# Altium project NIR-Spec-Motherboard.PrjPcb
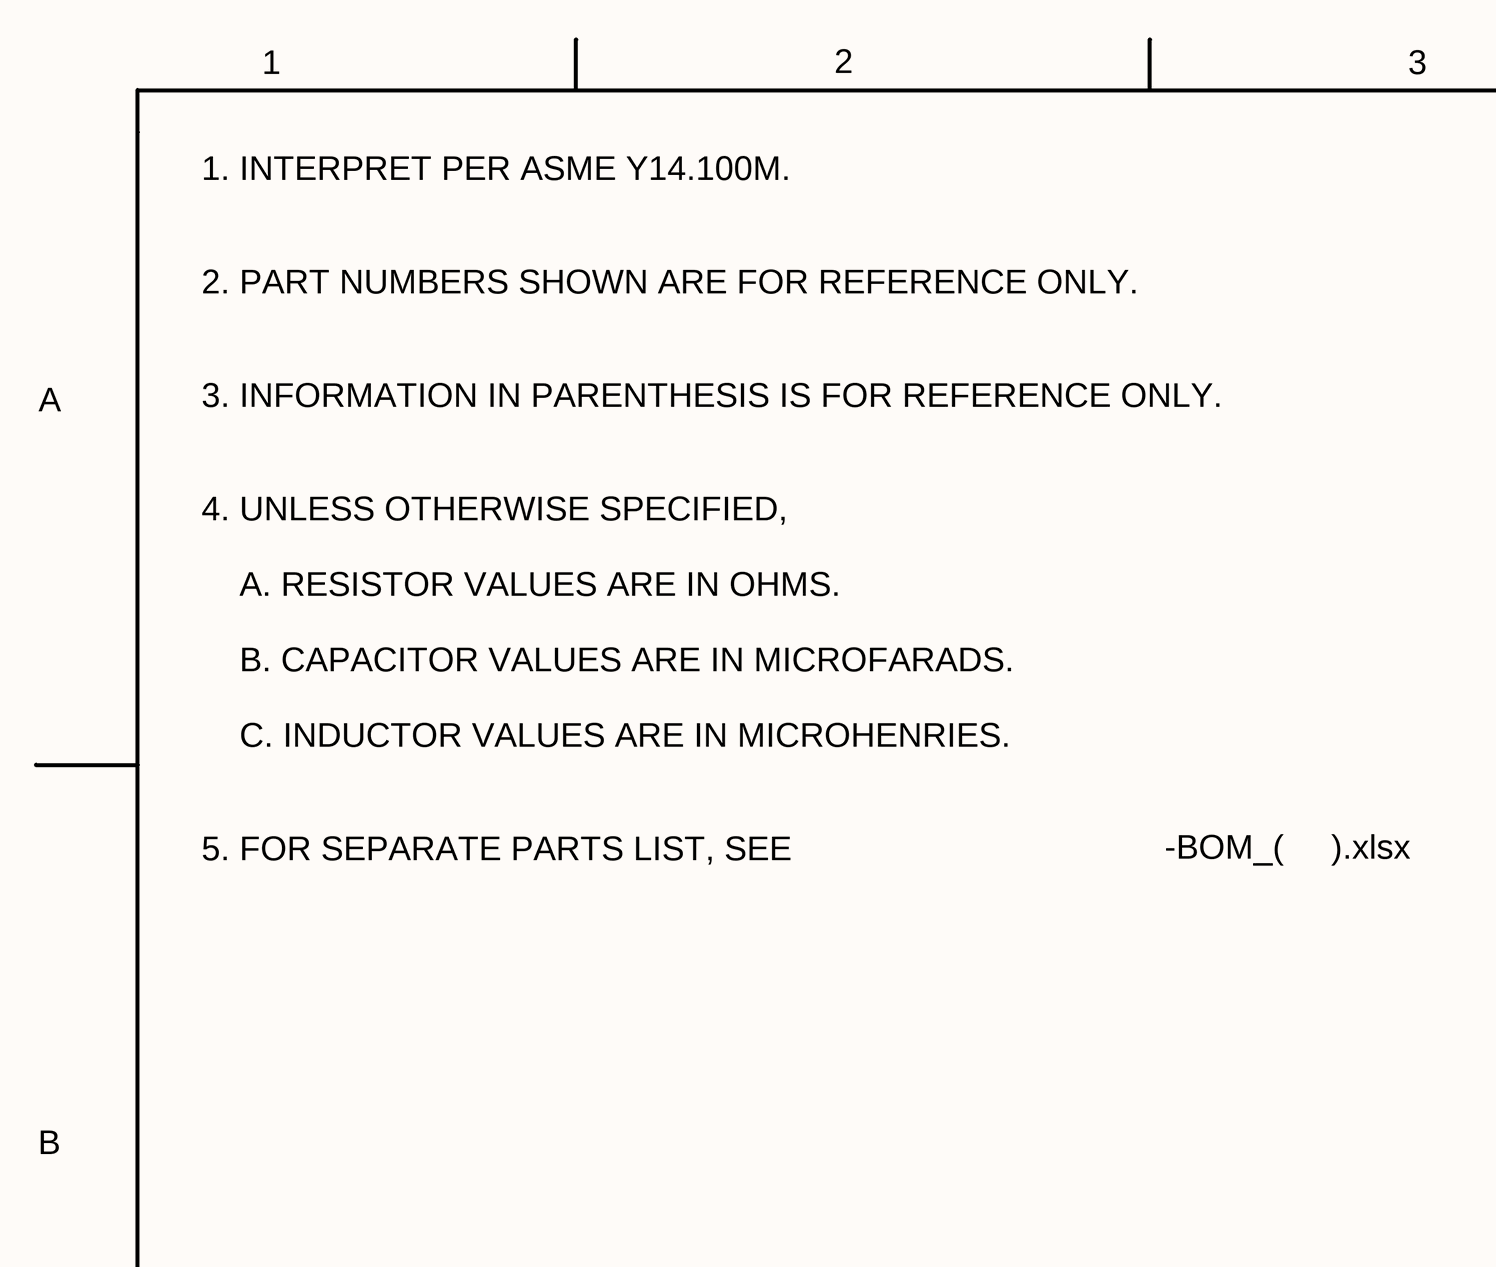
[diagram p0: NIR-Spec-Motherboard-SCH_SH1_(02).SchDoc, top left]
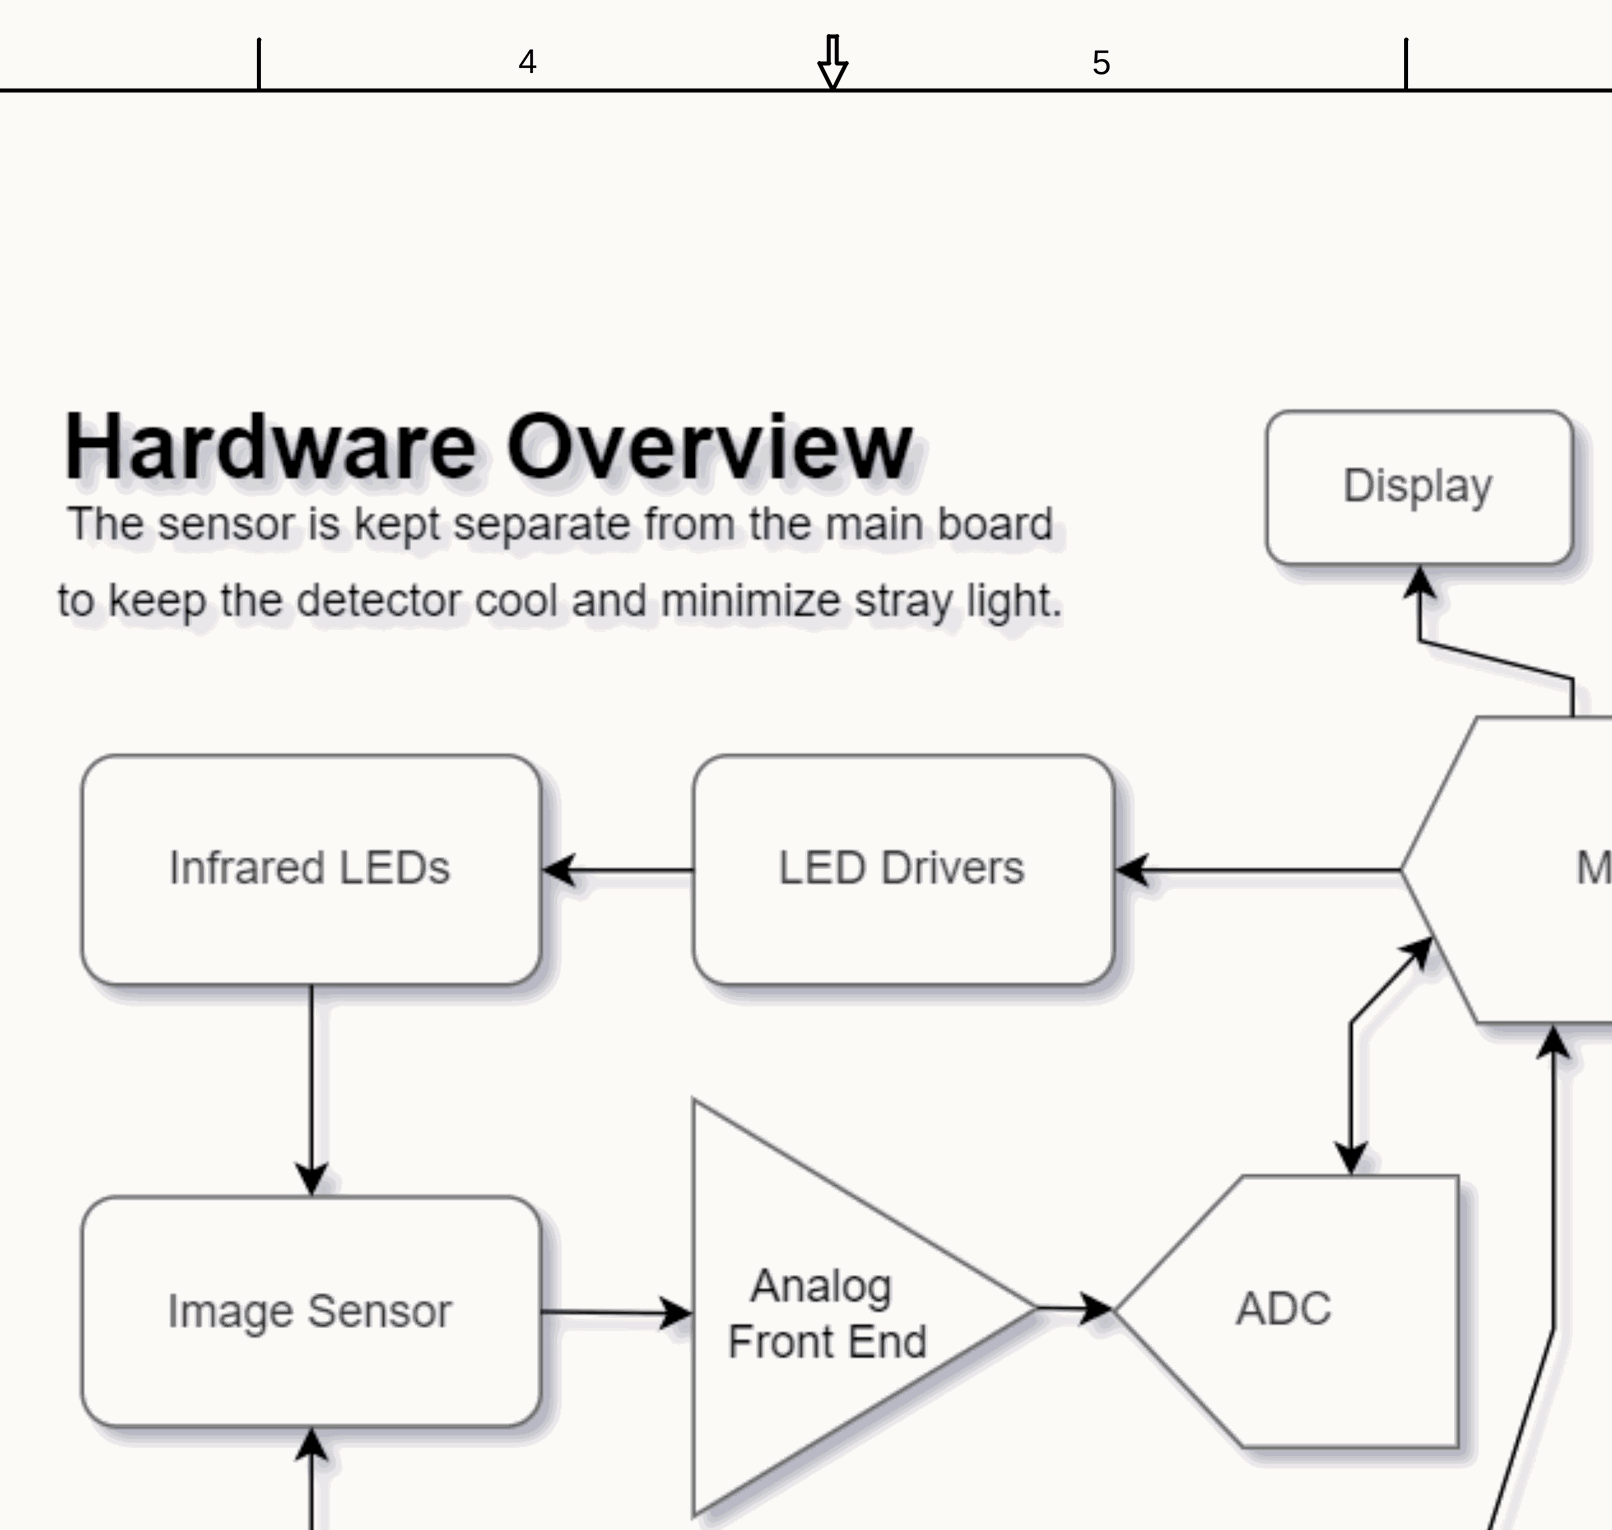
[diagram p1: NIR-Spec-Motherboard-SCH_SH1_(02).SchDoc, top middle]
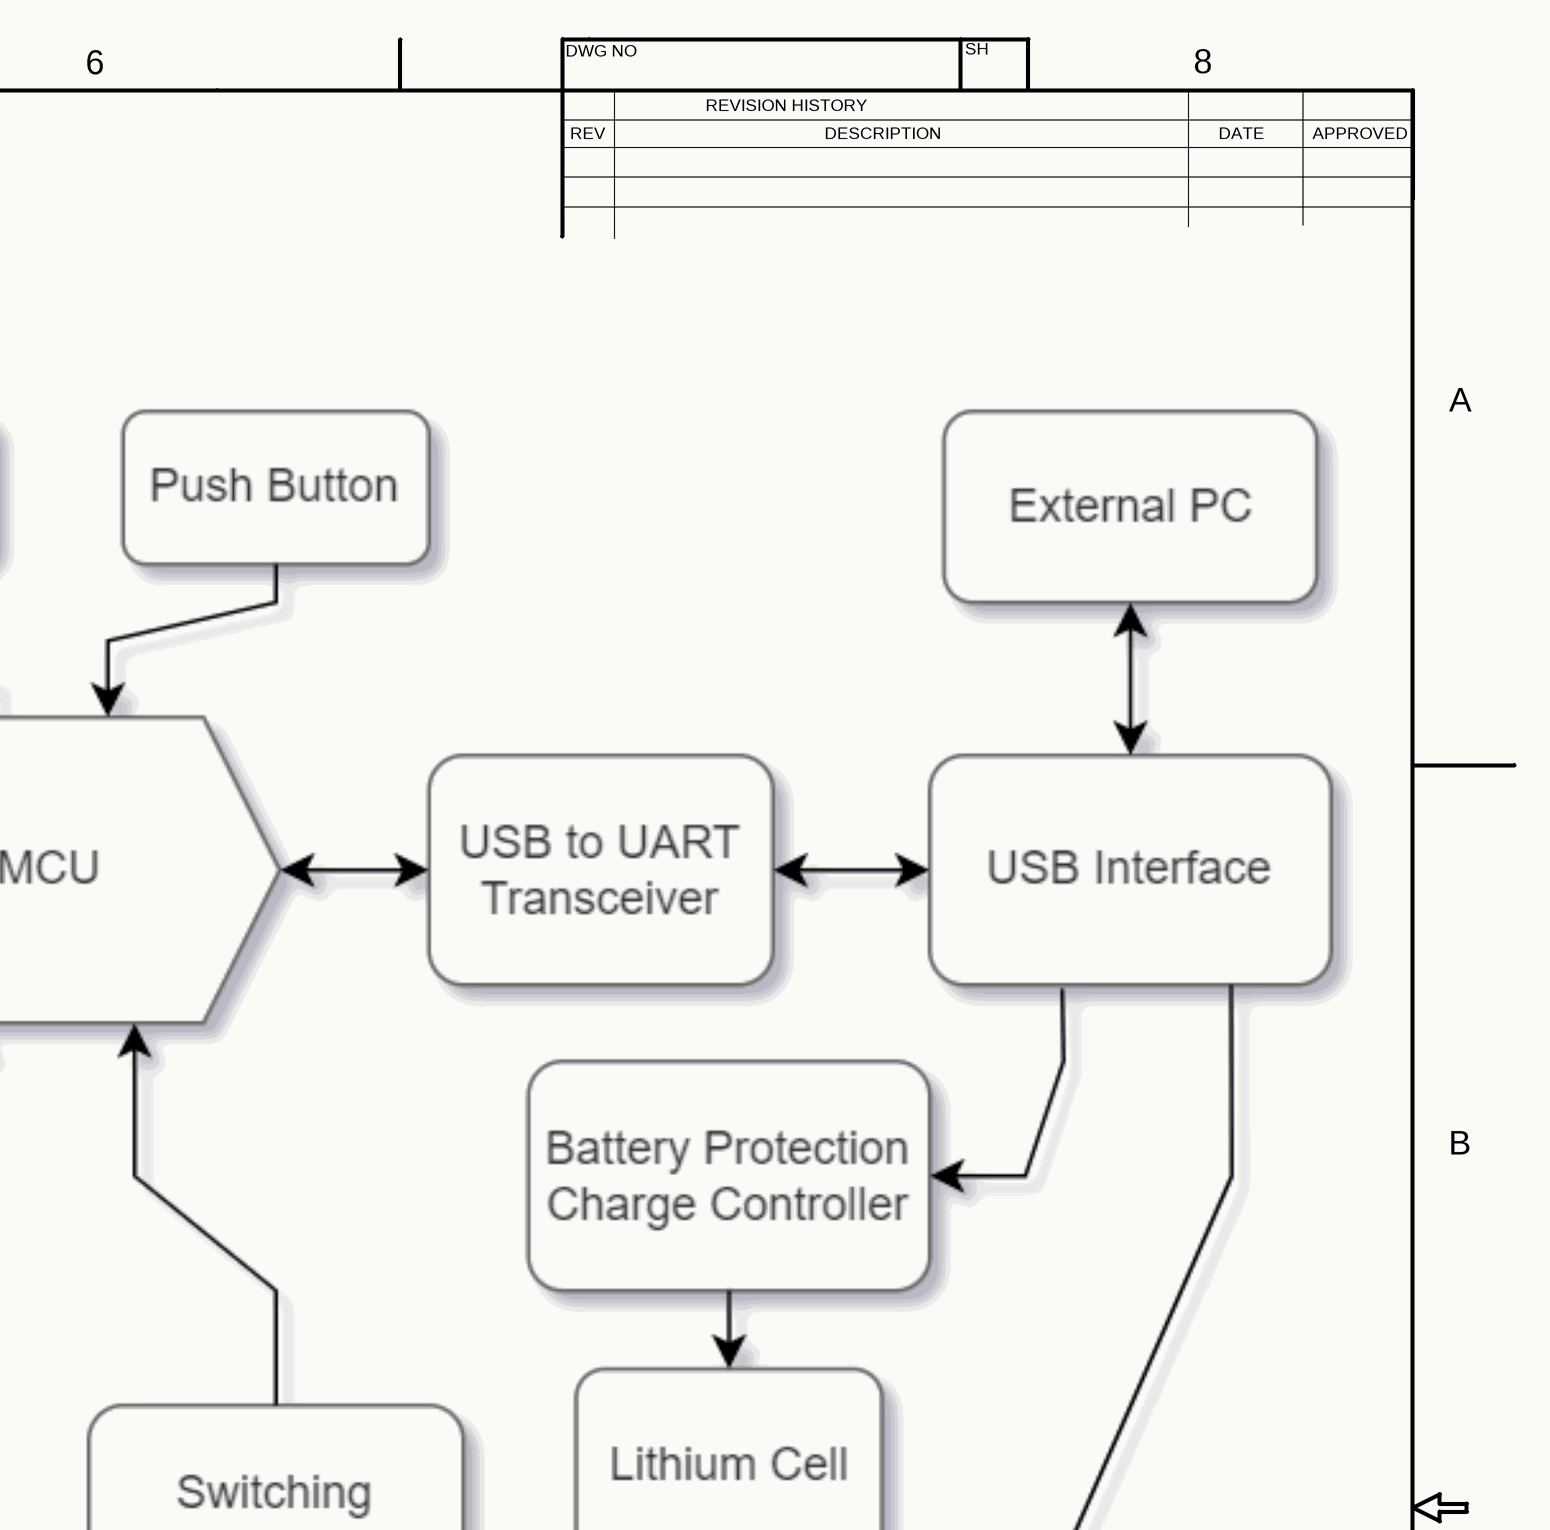
[diagram p2: NIR-Spec-Motherboard-SCH_SH1_(02).SchDoc, top right]
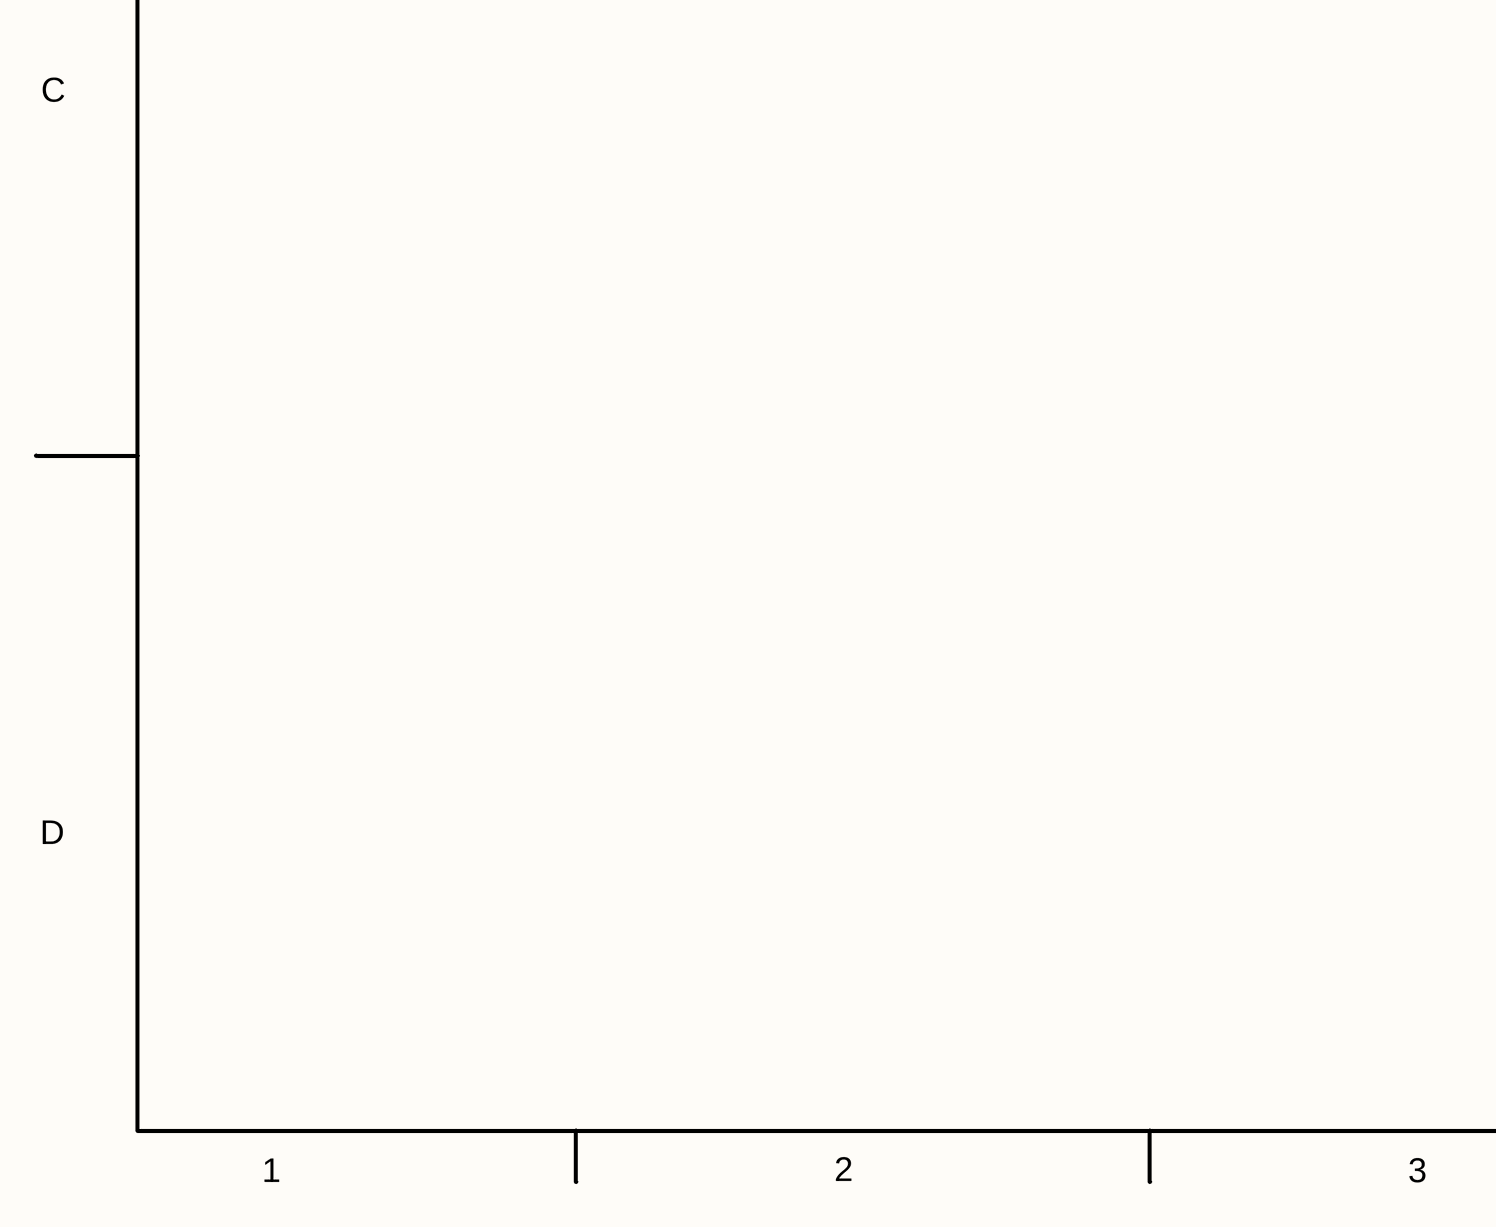
[diagram p3: NIR-Spec-Motherboard-SCH_SH1_(02).SchDoc, bottom left]
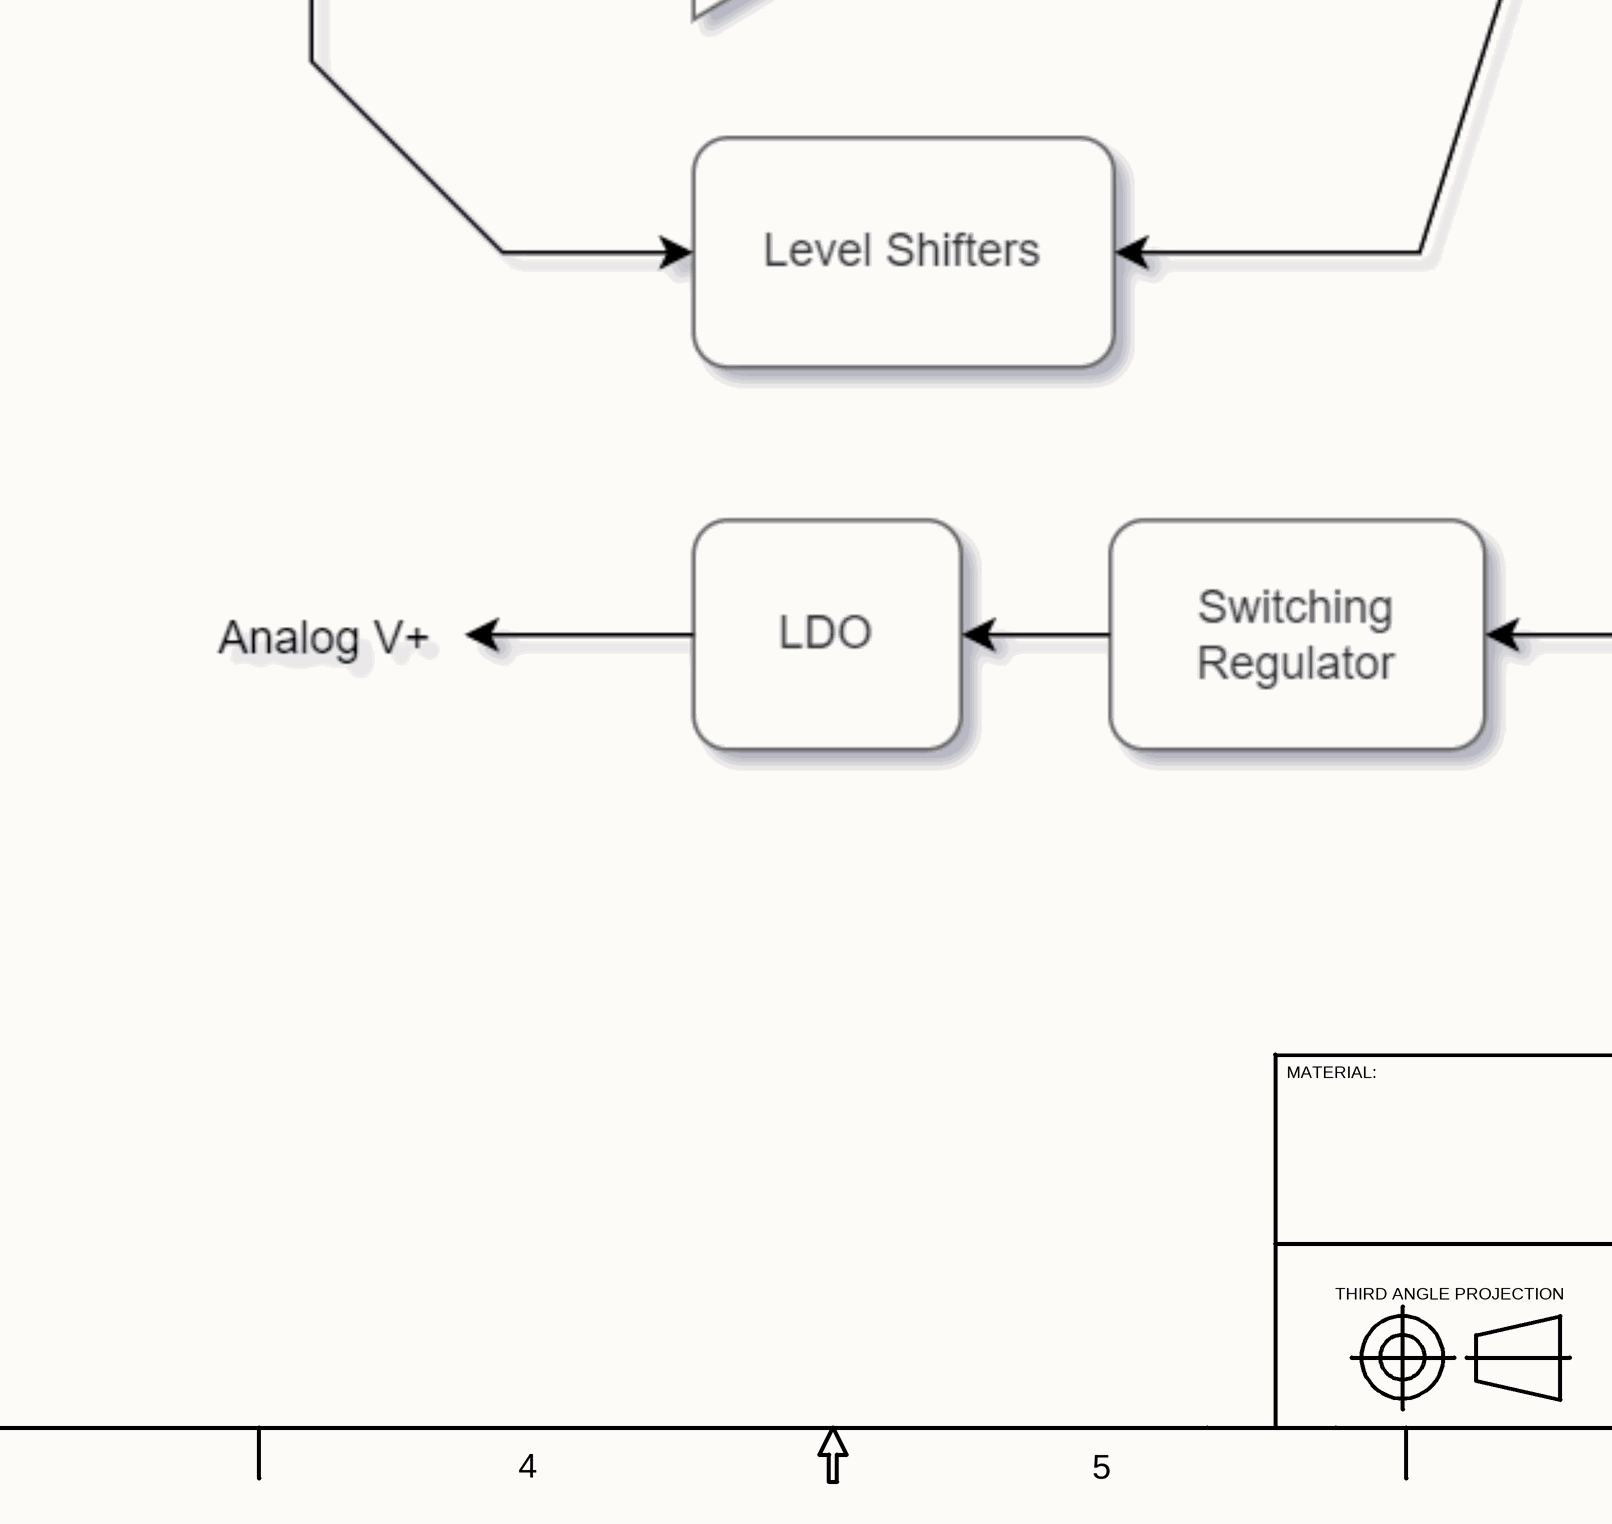
[diagram p4: NIR-Spec-Motherboard-SCH_SH1_(02).SchDoc, bottom middle]
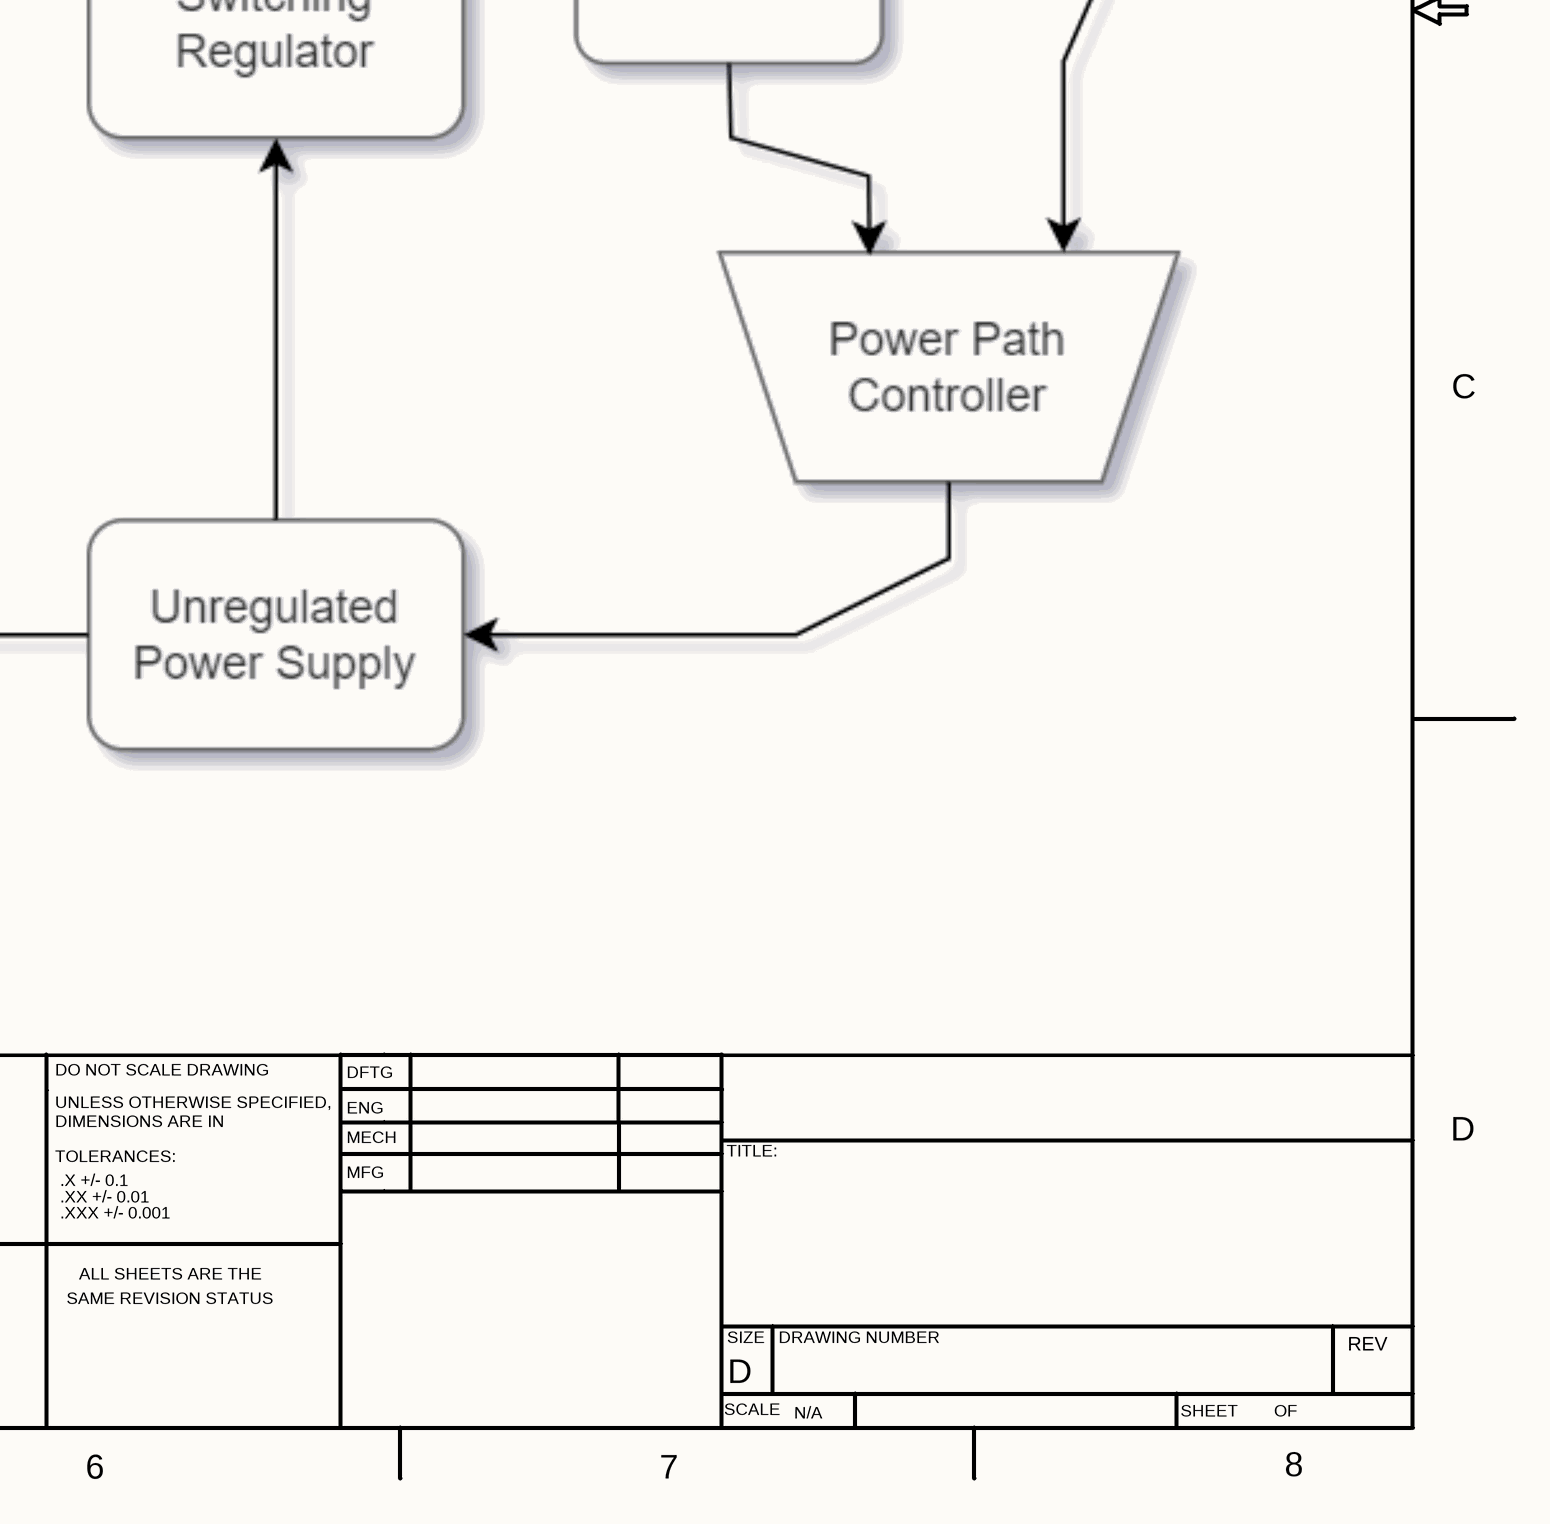
[diagram p5: NIR-Spec-Motherboard-SCH_SH1_(02).SchDoc, bottom right]
Company: -; DateDftg: -; DateEng: -; DocNumber: NIR-Spec; DocNumberPCB: NIR-Spec-PCB; Hist1Appr: -; Hist1Date: -; Hist1Desc: -; Hist1Rev: 01; Hist2Appr: -; Hist2Date: -; Hist2Desc: -; Hist2Rev: -; Hist3Appr: -; Hist3Date: -; Hist3Desc: -; Hist3Rev: -; NameDftg: K. KIDD; NameEng: K. KIDD; Rev: 02; Title0: NIR Spec Motherboard; Title1: SWIR Spectrophotometer; TitleCCA: CIRCUIT CARD ASSEMBLY,; TitlePCB: PRINTED CIRCUIT BOARD,; TitleSCH: SCHEMATIC, CCA,
3 sheets, 132 parts. Net scope: global (net labels, ports and power ports of the same name join across sheets).
Board file: NIR-Spec-Motherboard.PcbDoc
Sheets:
  NIR-Spec-Motherboard-SCH_SH1_(02).SchDoc
  NIR-Spec-Motherboard-SCH_SH2_(02).SchDoc
  NIR-Spec-Motherboard-SCH_SH3_(02).SchDoc

## Sheet NIR-Spec-Motherboard-SCH_SH1_(02).SchDoc: SCHEMATIC, CCA,
size 863 x 558 mm; DocumentNumber: NIR-Spec-1; SheetNumber: 1; SheetTotal: 3

### Notes on the sheet
- 1
- 2
- 3
- 4
- 5
- 6
- DWG NO
- REVISION HISTORY
- SH
- 8
- REV
- DESCRIPTION
- DATE
- APPROVED
- A
- -BOM_(
- ).xlsx
- 1. INTERPRET PER ASME Y14.100M.
  2. PART NUMBERS SHOWN ARE FOR REFERENCE ONLY.
  3. INFORMATION IN PARENTHESIS IS FOR REFERENCE ONLY.
  4. UNLESS OTHERWISE SPECIFIED,
  A. RESISTOR VALUES ARE IN OHMS.
  B. CAPACITOR VALUES ARE IN MICROFARADS.
  C. INDUCTOR VALUES ARE IN MICROHENRIES.
  5. FOR SEPARATE PARTS LIST, SEE
- B
- C
- MATERIAL:
- DO NOT SCALE DRAWING
- UNLESS OTHERWISE SPECIFIED,
- ENG
- DFTG
- D
- DIMENSIONS ARE IN
- TOLERANCES:
- MECH
- MFG
- TITLE:
- .X +/- 0.1
- .XX +/- 0.01
- .XXX +/- 0.001
- THIRD ANGLE PROJECTION
- SAME REVISION STATUS
- ALL SHEETS ARE THE
- SIZE
- DRAWING NUMBER
- SCALE
- N/A
- SHEET        OF
- 7

## Sheet NIR-Spec-Motherboard-SCH_SH2_(02).SchDoc: SCHEMATIC
size 863 x 558 mm; DocumentNumber: NIR-Spec-2; SheetNumber: 2; SheetTotal: 3; PageSetup: Record=PageOptions|CenterHorizontal=True|CenterVertical=True|PrintScale=0.98|XCorrection=1.00|YCorrection=1.00|PrintKind=2|BorderSize=5000000|LeftOffset=0|BottomOffset=0|Orientation=2|PaperLength=1000|PaperWidth=1000|Scale=100|PaperSource=15|PrintQuality=1200|MediaType=1|DitherType=10|PaperKind=11 x 17|PrintScaleMode=1
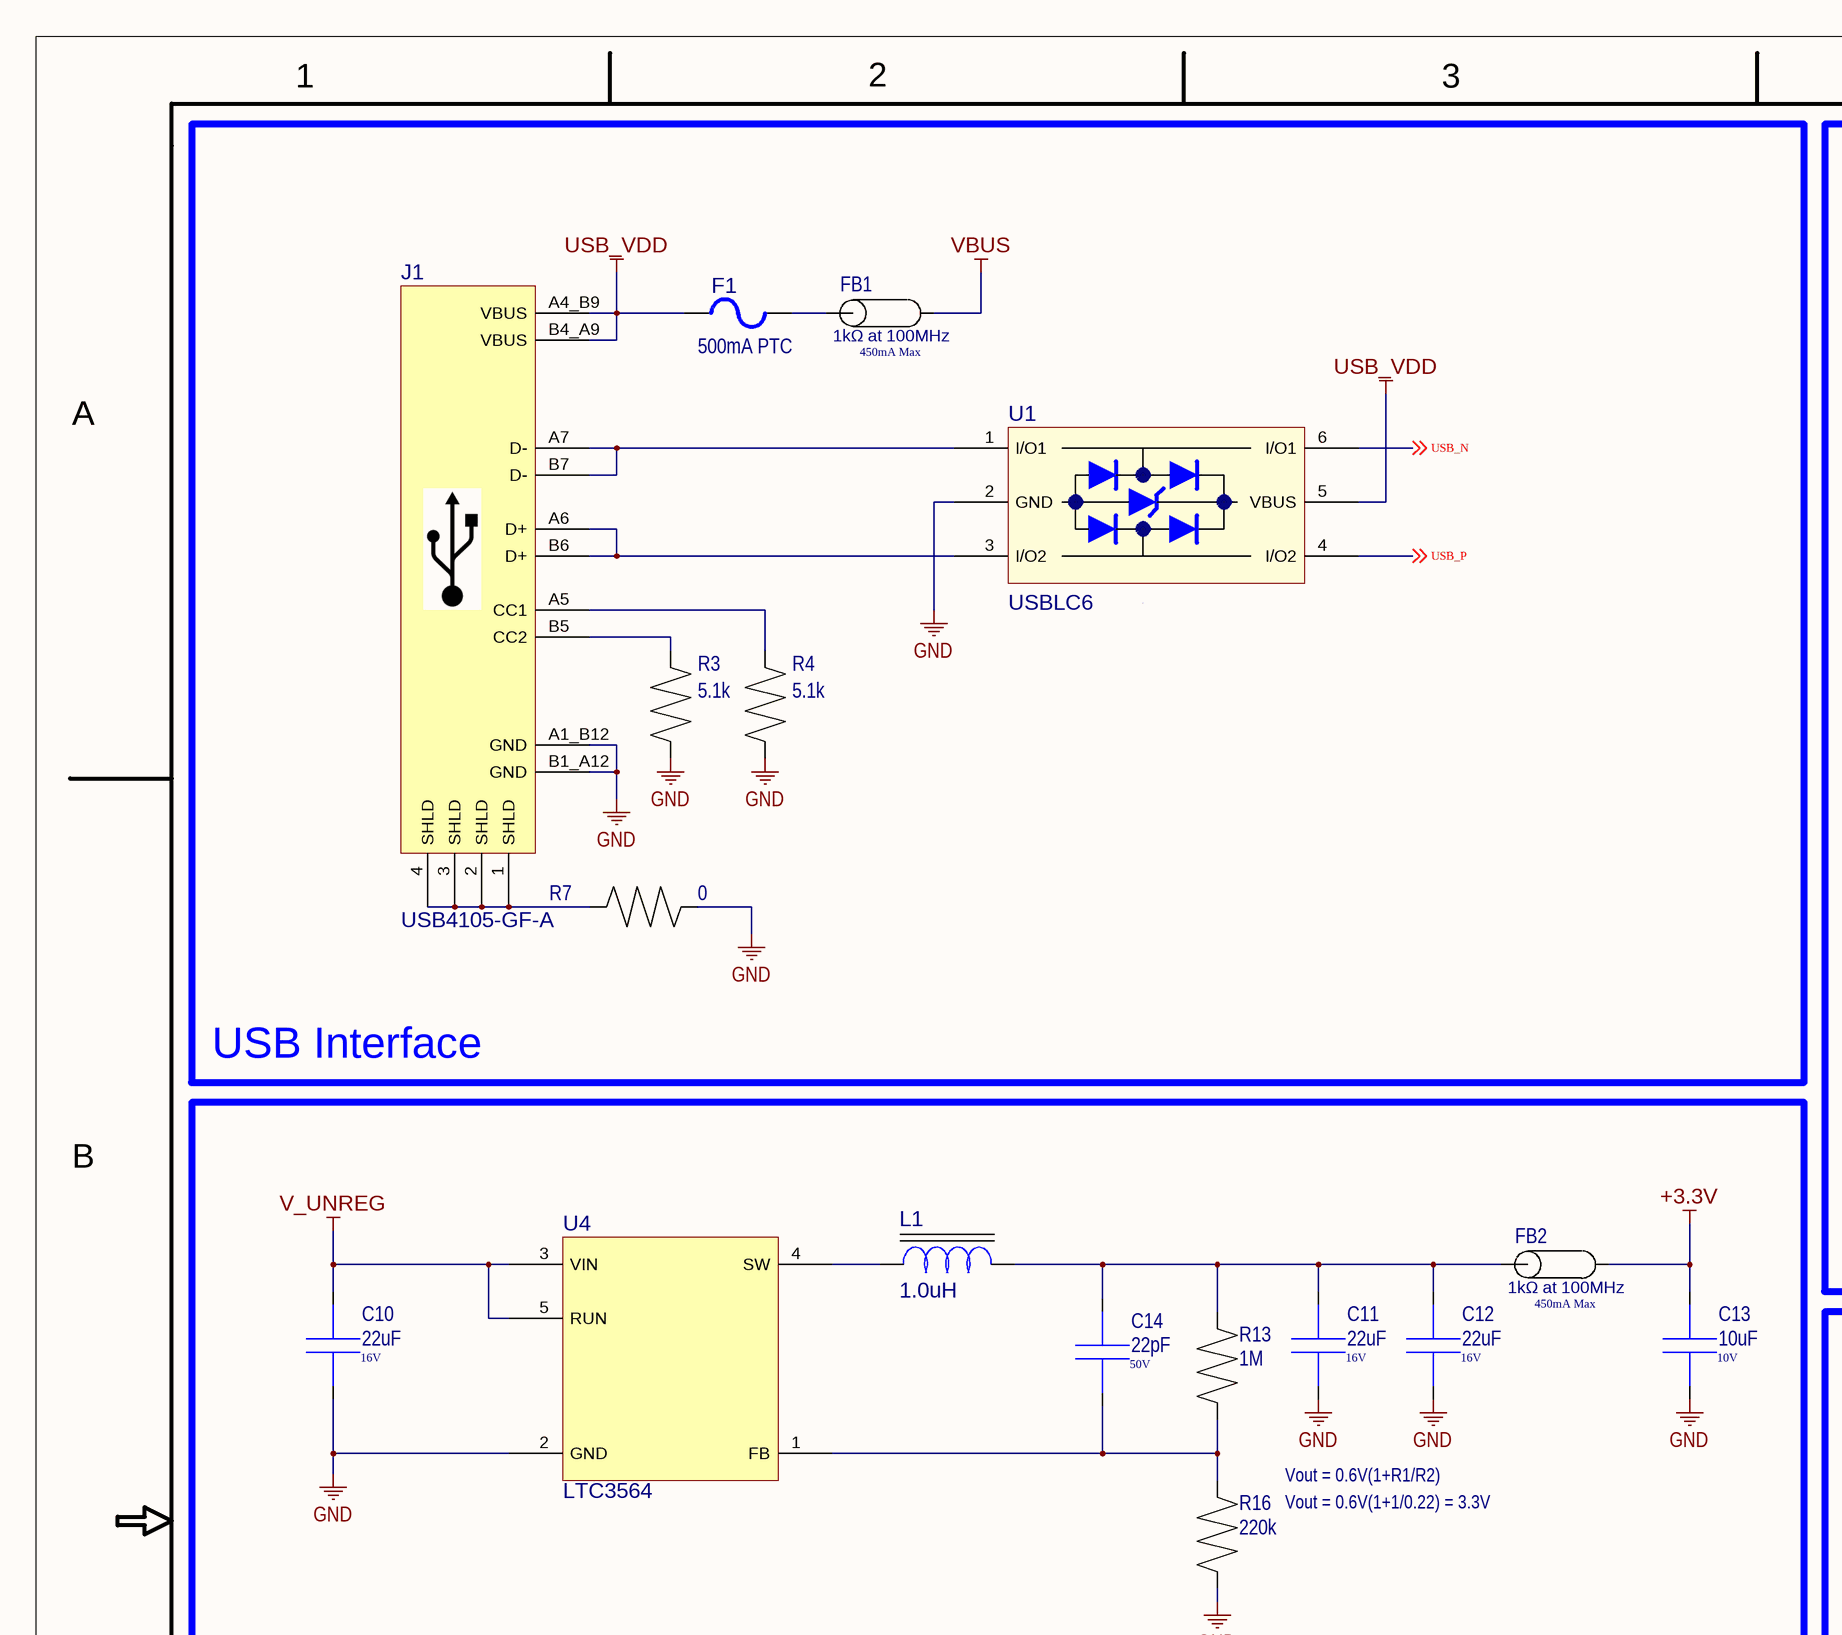
[diagram p6: NIR-Spec-Motherboard-SCH_SH2_(02).SchDoc, top left]
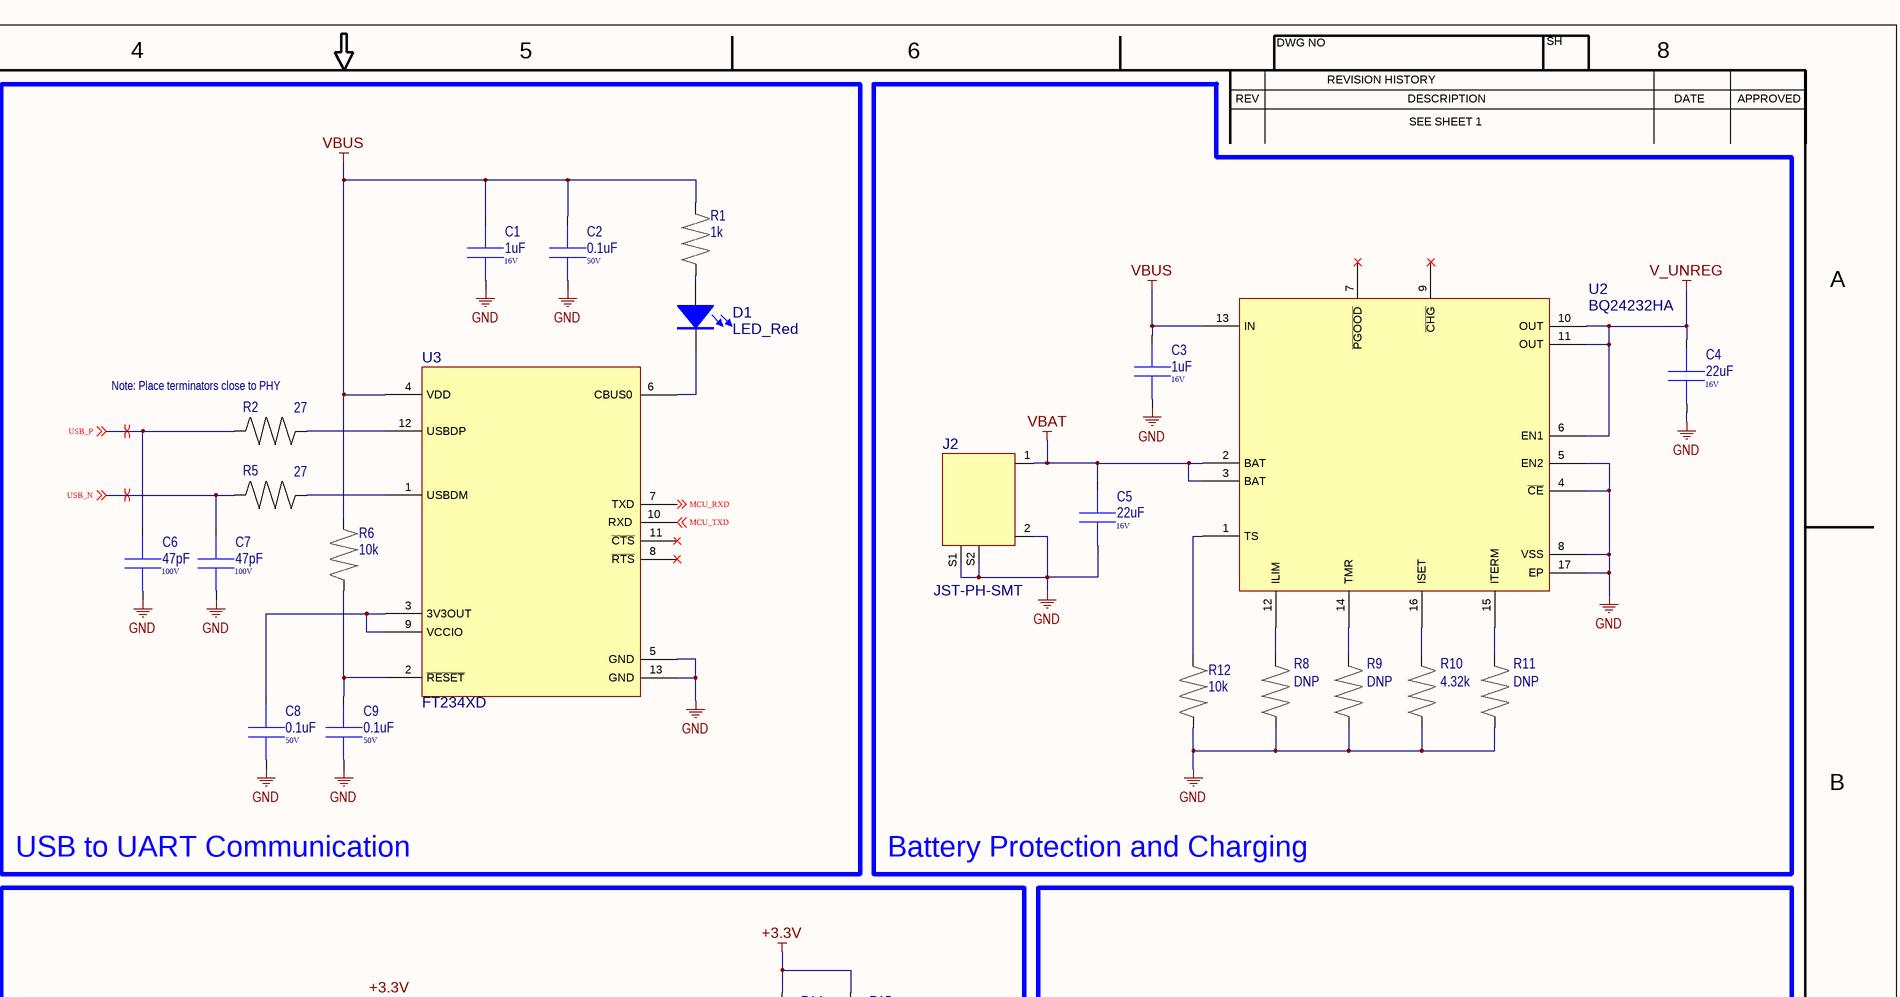
[diagram p7: NIR-Spec-Motherboard-SCH_SH2_(02).SchDoc, top right]
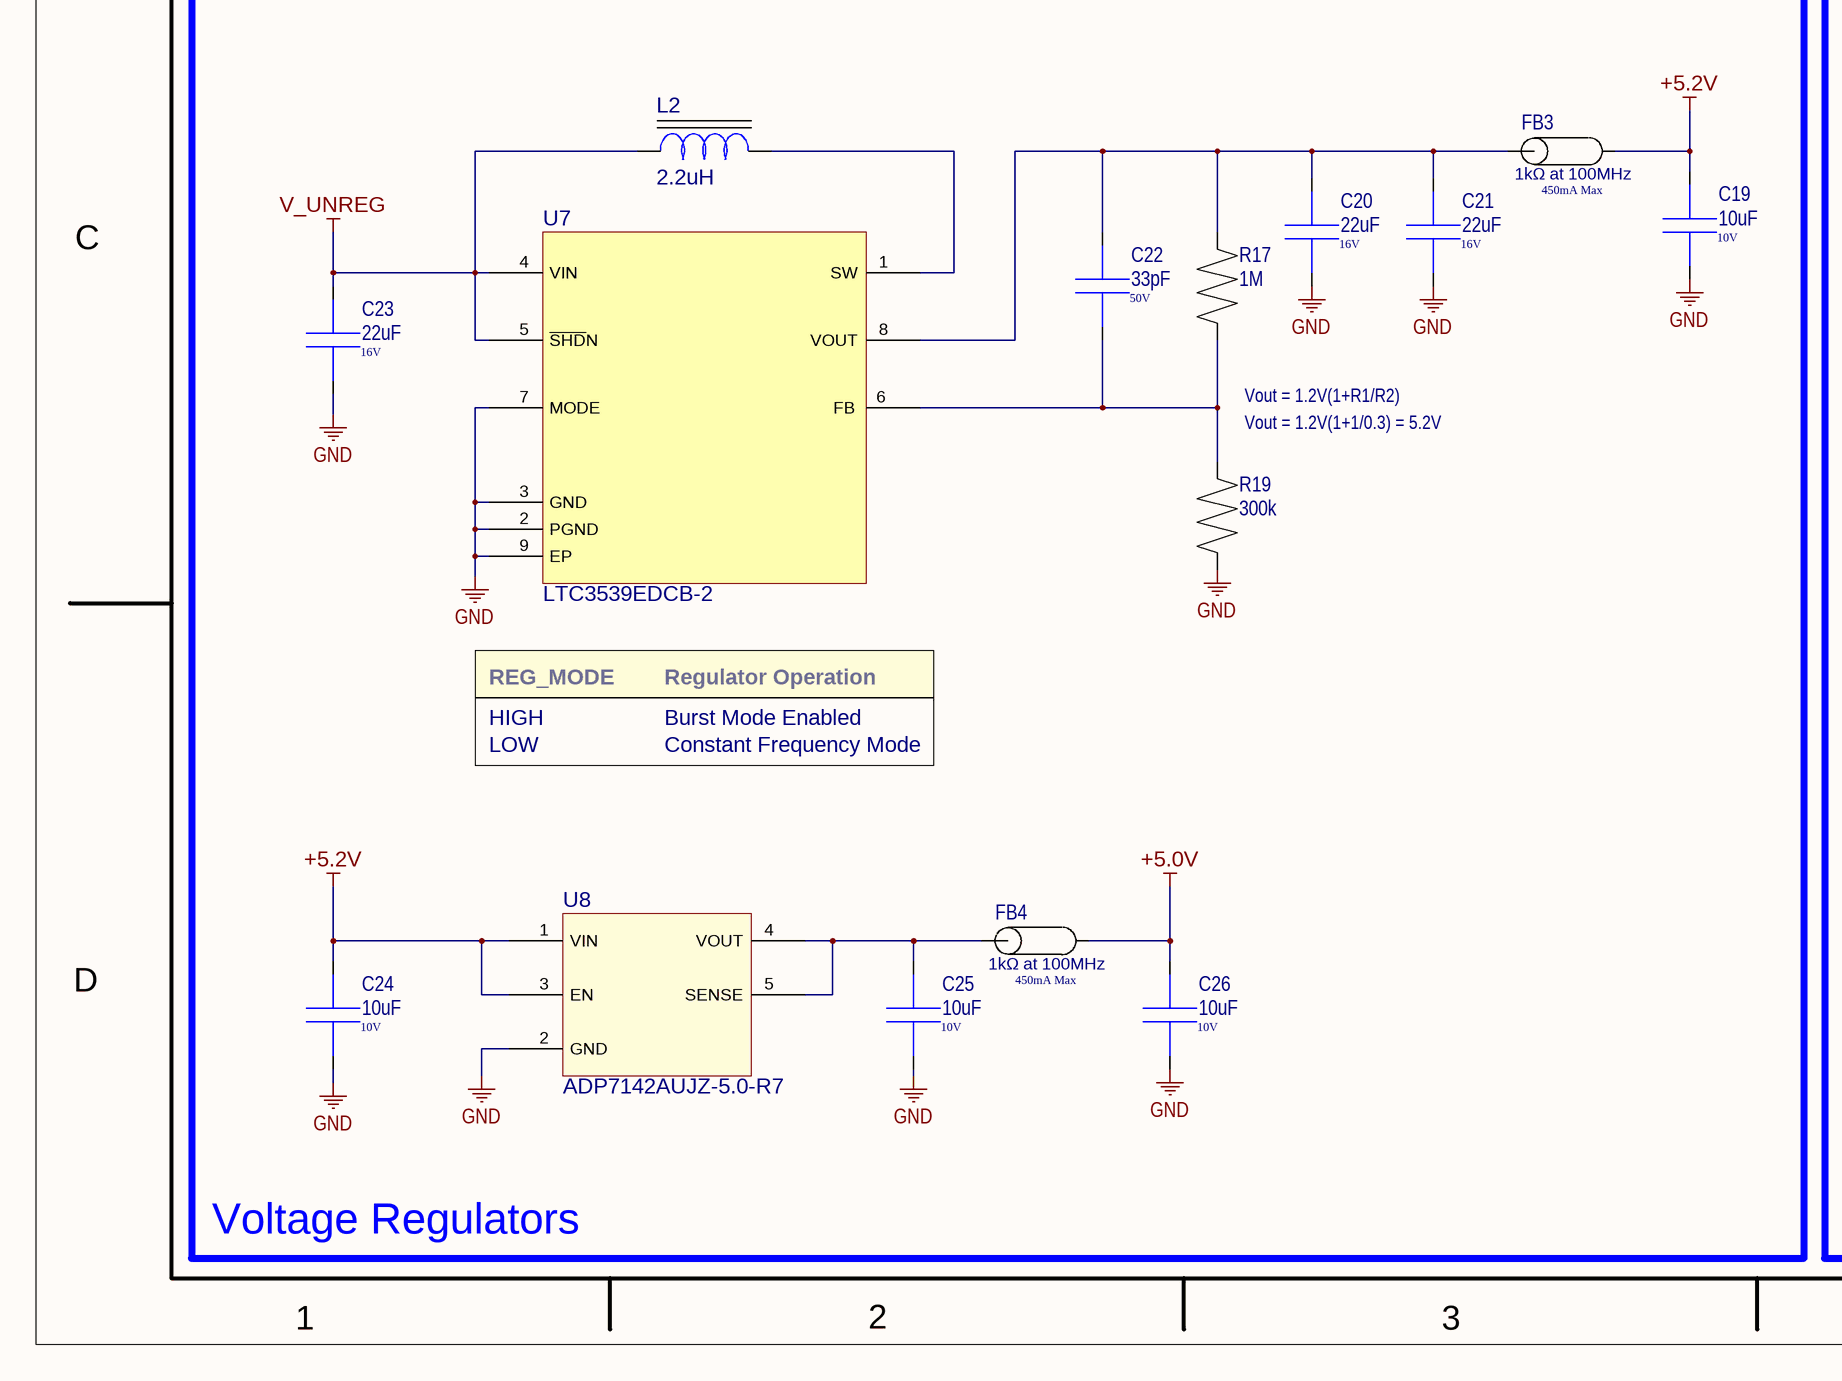
[diagram p8: NIR-Spec-Motherboard-SCH_SH2_(02).SchDoc, bottom left]
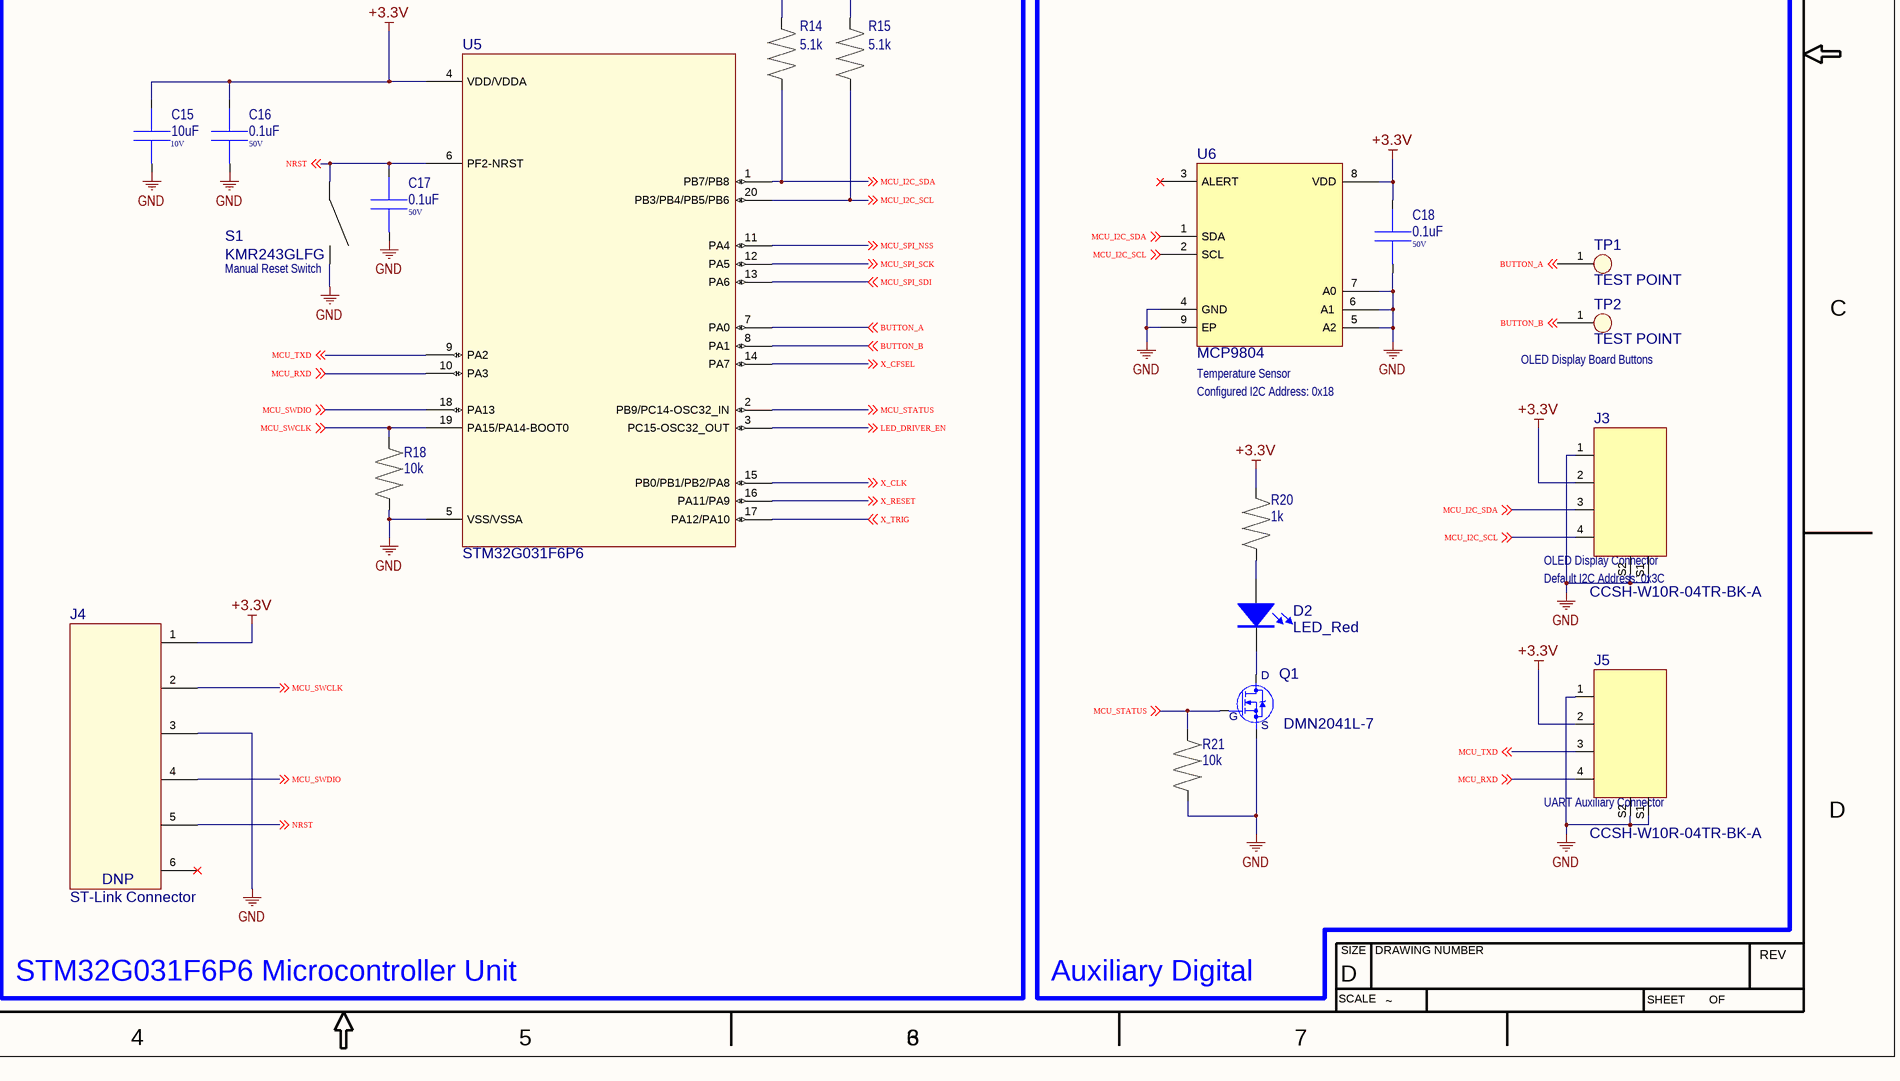
[diagram p9: NIR-Spec-Motherboard-SCH_SH2_(02).SchDoc, bottom right]

### Parts
C1  1uF  Voltage: 16V  [0603]
C2  0.1uF  Voltage: 50V  [0603]
C3  1uF  Voltage: 16V  [0603]
C4  22uF  Voltage: 16V  [0805]
C5  22uF  Voltage: 16V  [0805]
C6  47pF  Voltage: 100V  [0603]
C7  47pF  Voltage: 100V  [0603]
C8  0.1uF  Voltage: 50V  [0603]
C9  0.1uF  Voltage: 50V  [0603]
C10  22uF  Voltage: 16V  [0805]
C11  22uF  Voltage: 16V  [0805]
C12  22uF  Voltage: 16V  [0805]
C13  10uF  Voltage: 10V  [0603]
C14  22pF  Voltage: 50V  [0603]
C15  10uF  Voltage: 10V  [0603]
C16  0.1uF  Voltage: 50V  [0603]
C17  0.1uF  Voltage: 50V  [0603]
C18  0.1uF  Voltage: 50V  [0603]
C19  10uF  Voltage: 10V  [0603]
C20  22uF  Voltage: 16V  [0805]
C21  22uF  Voltage: 16V  [0805]
C22  33pF  Voltage: 50V  [0603]
C23  22uF  Voltage: 16V  [0805]
C24  10uF  Voltage: 10V  [0603]
C25  10uF  Voltage: 10V  [0603]
C26  10uF  Voltage: 10V  [0603]
D1  LED_Red  [0603_LED_Red]
D2  LED_Red  [0603_LED_Red]
F1  500mA PTC  [0603]
FB1  Rated Current: 450mA Max  Impedance: 1kΩ at 100MHz  [0603]  (hidden comment: Ferrite_Bead)
FB2  Rated Current: 450mA Max  Impedance: 1kΩ at 100MHz  [0603]  (hidden comment: Ferrite_Bead)
FB3  Rated Current: 450mA Max  Impedance: 1kΩ at 100MHz  [0603]  (hidden comment: Ferrite_Bead)
FB4  Rated Current: 450mA Max  Impedance: 1kΩ at 100MHz  [0603]  (hidden comment: Ferrite_Bead)
J1  USB4105-GF-A  [USB4105-GF-A]
J2  JST-PH-SMT  [JST-PH-SMT]
J3  CCSH-W10R-04TR-BK-A  [PCBComponent_1]
J4  DNP  [851-43-006-10-001000]
J5  CCSH-W10R-04TR-BK-A  [PCBComponent_1]
L1  1.0uH  [1206]
L2  2.2uH  [1206]
Q1  DMN2041L-7  [SOT-23-3]
R1  1k  [0603]
R2  27  [0603]
R3  5.1k  [0603]
R4  5.1k  [0603]
R5  27  [0603]
R6  10k  [0603]
R7  0  [0603]
R8  DNP  [0603]
R9  DNP  [0603]
R10  4.32k  [0603]
R11  DNP  [0603]
R12  10k  [0603]
R13  1M  [0603]
R14  5.1k  [0603]
R15  5.1k  [0603]
R16  220k  [0603]
R17  1M  [0603]
R18  10k  [0603]
R19  300k  [0603]
R20  1k  [0603]
R21  10k  [0603]
S1  KMR243GLFG  [KMR 2 Series]
TP1  TEST POINT  [30x40 TP]
TP2  TEST POINT  [30x40 TP]
U1  USBLC6  [SOT-23-6_N]
U2  BQ24232HA  [QFN-16]
U3  FT234XD  [DFN-12]
U4  LTC3564  [TSOT-23-5]
U5  STM32G031F6P6  [TSSOP-20]
U6  MCP9804  [DFN-8]
U7  LTC3539EDCB-2  [DFN-8 2x3]
U8  ADP7142AUJZ-5.0-R7  [TSOT-23-5]

### Blocks framed on the sheet
USB Interface: F1 FB1 J1 R3 R4 R7 U1
USB to UART Communication: C1 C2 C6-C9 D1 R1 R2 R5 R6 U3
Battery Protection and Charging: C3-C5 J2 R8-R12 U2
Voltage Regulators: C10-C14 C19-C26 FB2-FB4 L1 L2 R13 R16 R17 R19 U4 U7 U8
STM32G031F6P6 Microcontroller Unit: C15-C17 J4 R14 R15 R18 S1 U5
Auxiliary Digital: C18 D2 J3 J5 Q1 R20 R21 TP1 TP2 U6

### Nets
+3.3V: C13.2 C15.2 C16.2 C18.2 FB2.2 J3.2 J4.1 J5.2 R14.2 R15.2 R20.2 U5.4(VDD/VDDA) U6.8(VDD)
+5.0V: C26.2 FB4.2
+5.2V: C19.2 C24.2 FB3.2 U8.1(VIN) U8.3(EN)
GND: C1.1 C2.1 C3.1 C4.1 C5.1 C6.1 C7.1 C8.1 C9.1 C10.1 C11.1 C12.1 C13.1 C15.1 C16.1 C17.1 C18.1 C19.1 C20.1 C21.1 C23.1 C24.1 C25.1 C26.1 J1.A1_B12(GND) J1.B1_A12(GND) J2.2 J2.S1 J2.S2 J3.1 J3.S1 J3.S2 J4.3 J5.1 J5.S1 J5.S2 Q1.3(S) R3.1 R4.1 R7.1 R8.1 R9.1 R10.1 R11.1 R12.2 R16.2 R18.2 R19.2 R21.2 S1.2 U1.2(GND) U2.4(~{CE}) U2.5(EN2) U2.8(VSS) U2.17(EP) U3.5(GND) U3.13(GND) U4.2(GND) U5.5(VSS/VSSA) U6.4(GND) U6.5(A2) U6.6(A1) U6.7(A0) U6.9(EP) U7.2(PGND) U7.3(GND) U7.7(MODE) U7.9(EP) U8.2(GND)
USB_VDD: F1.1 J1.A4_B9(VBUS) J1.B4_A9(VBUS) U1.5(VBUS)
V_UNREG: C4.2 C10.2 C23.2 L2.1 U2.6(EN1) U2.10(OUT) U2.11(OUT) U4.3(VIN) U4.5(RUN) U7.4(VIN) U7.5(~{SHD}N)
VBAT: C5.2 J2.1 U2.2(BAT) U2.3(BAT)
VBUS: C1.2 C2.2 C3.2 FB1.2 R1.2 R6.1 U2.13(IN) U3.4(VDD)
BUTTON_A: TP1.1 U5.7(PA0) ; off-sheet BUTTON_A
BUTTON_B: TP2.1 U5.8(PA1) ; off-sheet BUTTON_B
LED_DRIVER_EN: U5.3(PC15-OSC32_OUT) ; off-sheet LED_DRIVER_EN
MCU_I2C_SCL: J3.4 R15.1 U5.20(PB3/PB4/PB5/PB6) U6.2(SCL) ; off-sheet MCU_I2C_SCL
MCU_I2C_SDA: J3.3 R14.1 U5.1(PB7/PB8) U6.1(SDA) ; off-sheet MCU_I2C_SDA
MCU_RXD: J5.4 U3.7(TXD) U5.10(PA3) ; off-sheet MCU_RXD
MCU_SPI_NSS: U5.11(PA4) ; off-sheet MCU_SPI_NSS
MCU_SPI_SCK: U5.12(PA5) ; off-sheet MCU_SPI_SCK
MCU_SPI_SDI: U5.13(PA6) ; off-sheet MCU_SPI_SDI
MCU_STATUS: Q1.1(G) R21.1 U5.2(PB9/PC14-OSC32_IN) ; off-sheet MCU_STATUS
MCU_SWCLK: J4.2 R18.1 U5.19(PA15/PA14-BOOT0) ; off-sheet MCU_SWCLK
MCU_SWDIO: J4.4 U5.18(PA13) ; off-sheet MCU_SWDIO
MCU_TXD: J5.3 U3.10(RXD) U5.9(PA2) ; off-sheet MCU_TXD
NRST: C17.2 J4.5 S1.1 U5.6(PF2-NRST) ; off-sheet NRST
USB_N: C7.2 R5.1 U1.6(I/O1) ; off-sheet USB_N
USB_P: C6.2 R2.1 U1.4(I/O2) ; off-sheet USB_P
X_CFSEL: U5.14(PA7) ; off-sheet X_CFSEL
X_CLK: U5.15(PB0/PB1/PB2/PA8) ; off-sheet X_CLK
X_RESET: U5.16(PA11/PA9) ; off-sheet X_RESET
X_TRIG: U5.17(PA12/PA10) ; off-sheet X_TRIG
NetC8_2: C8.2 U3.3(3V3OUT) U3.9(VCCIO)
NetC9_2: C9.2 R6.2 U3.2(~{RESET})
NetC11_2: C11.2 C12.2 C14.2 FB2.1 L1.2 R13.1
NetC14_1: C14.1 R13.2 R16.1 U4.1(FB)
NetC20_2: C20.2 C21.2 C22.2 FB3.1 R17.1 U7.8(VOUT)
NetC22_1: C22.1 R17.2 R19.1 U7.6(FB)
NetC25_2: C25.2 FB4.1 U8.4(VOUT) U8.5(SENSE)
NetD1_1: D1.1(A) R1.1
NetD1_2: D1.2(K) U3.6(CBUS0)
NetD2_1: D2.1(A) R20.1
NetD2_2: D2.2(K) Q1.2(D)
NetF1_2: F1.2 FB1.1
NetJ1_1: J1.1(SHLD) J1.2(SHLD) J1.3(SHLD) J1.4(SHLD) R7.2
NetJ1_A5: J1.A5(CC1) R4.2
NetJ1_A6: J1.A6(D+) J1.B6(D+) U1.3(I/O2)
NetJ1_A7: J1.A7(D-) J1.B7(D-) U1.1(I/O1)
NetJ1_B5: J1.B5(CC2) R3.2
NetL1_1: L1.1 U4.4(SW)
NetL2_2: L2.2 U7.1(SW)
NetR2_2: R2.2 U3.12(USBDP)
NetR5_2: R5.2 U3.1(USBDM)
NetR8_2: R8.2 U2.12(ILIM)
NetR9_2: R9.2 U2.14(TMR)
NetR10_2: R10.2 U2.16(ISET)
NetR11_2: R11.2 U2.15(ITERM)
NetR12_1: R12.1 U2.1(TS)

Not connected (* = marked no-connect by the designer): J4 6*; U2 7(~{PGOOD})* 9(~{CHG})*; U3 8(~{RTS})* 11(~{CTS})*; U6 3(ALERT)*

### Layout directives
differential pair: USB_N, USB_P

### Notes on the sheet
- 1
- 2
- 3
- 4
- 5
- 6
- DWG NO
- REVISION HISTORY
- SH
- 8
- REV
- DESCRIPTION
- SEE SHEET 1
- DATE
- APPROVED
- A
- Note: Place terminators close to PHY
- B
- Vout = 0.6V(1+1/0.22) = 3.3V
- Vout = 0.6V(1+R1/R2)
- (near S1) Manual Reset Switch
- C
- Temperature Sensor
- (near TP2) OLED Display Board Buttons
- (near R19) Vout = 1.2V(1+1/0.3) = 5.2V
- Vout = 1.2V(1+R1/R2)
- Configured I2C Address: 0x18
- OLED Display Connector
- REG_MODE
- Regulator Operation
- Default I2C Address: 0x3C
- HIGH
- LOW
- Burst Mode Enabled
- Constant Frequency Mode
- D
- UART Auxiliary Connector
- (near J4) ST-Link Connector
- SIZE
- DRAWING NUMBER
- SCALE
- ~
- SHEET        OF
- 7

### Library data of the parts
C1 C3 = CAP: CAP CER 1UF 10V X5R 0603; Part Number: GRM188R61C105KA12J; Manufacturer: Murata Electronics
  C1: ClassName: USB to UART PHY
  C3: ClassName: Power Path
C2 C8 C9 C16-C18 = CAP: CAP CER 0.1UF 50V X7R 0603; Part Number: C0603C104K5RAC3121; Manufacturer: KEMET
  C2 C8 C9: ClassName: USB to UART PHY
  C16 C17: ClassName: STM32 MCU
  C18: ClassName: Aux Digital
C4 C5 C10-C12 C20 C21 C23 = CAP: CAP CER 22UF 16V X5R 0805; Part Number: CL21A226MOCLRNC; Manufacturer: Samsung Electro-Mechanics
  C4 C5: ClassName: Power Path
  C10-C12: ClassName: 3.3V Regulator
  C20 C21 C23: ClassName: 6.0V Regulator
C6 C7 = CAP: CAP CER 10PF 50V NP0 0603; Part Number: 06031A470KAT2A; Manufacturer: Kyocera AVX; ClassName: USB to UART PHY
C13 C15 C19 C24-C26 = CAP: CAP CER 10UF 10V X6S 0603; Part Number: GRM188C81A106MA73D; Manufacturer: Murata Electronics
  C13: ClassName: 3.3V Regulator
  C15: ClassName: STM32 MCU
  C19: ClassName: 6.0V Regulator
  C24-C26: ClassName: 5.0V Regulator
C14 = CAP: CAP CER 22PF NP0 50V 0603; Part Number: VJ0603A220KXAAC; Manufacturer: Vishay; ClassName: 3.3V Regulator
C22 = CAP: CAP CER 33PF 50V NP0 0603; Part Number: 06035A330J4T4A; Manufacturer: Kyocera AVX; ClassName: 6.0V Regulator
D1 D2 = LED_Red: Standard LEDs - SMD HE Red 645 nm Water Clear; Part Number: SM0603HCL; Manufacturer: Bivar
  D1: ClassName: USB to UART PHY
  D2: ClassName: Aux Digital
F1 = FUSE: 500mA PTC Fuse; Part Number: MF-FSMF050X-2; Manufacturer: Bourns; ClassName: USB Interface
FB1-FB4 = Ferrite_Bead: Ferrite Beads 1000 OHM 25%; Manufacturer: Murata Electronics; Part Number: BLM18AG102SH1D
  FB1: ClassName: USB Interface
  FB2: ClassName: 3.3V Regulator
  FB3: ClassName: 6.0V Regulator
  FB4: ClassName: 5.0V Regulator
J1 = USB4105-GF-A: USB-C (USB TYPE-C) USB 2.0 Receptacle Connector 24 (16+8 Dummy) Position Surface Mount, Right Angle; Through Hole; Manufacturer: GCT; Part Number: USB4105-GF-A; ClassName: USB Interface
J3 J5 = CCSH-W10R-04TR-BK-A: Manufacturer: JST; Part Number: CCSH-W10R-04TR-BK-A; ClassName: Aux Digital
J4 = 851-43-006-10-001000: CONN, RECPT, 6 POS, 0.050" (1.27MM) GOLD TH; Manufacturer: Mill-max; Part Number: 851-43-006-10-001000; ClassName: STM32 MCU
L1 = SHIELDED_INDUCTOR: Part Number: MLP2016S1R0MT0S1; Manufacturer: TDK; ClassName: 3.3V Regulator
L2 = SHIELDED_INDUCTOR: Part Number: MLP2016H2R2MT0S1; Manufacturer: TDK; ClassName: 6.0V Regulator
Q1 = MOSFET_N: MOSFET, N CH, 3-PIN; Manufacturer: Diodes Incorporated; Part Number: DMN2041L-7; ClassName: Aux Digital
R1 R20 = RES: Thin Film Resistors - SMD CPF A 0603 1K0 0.1% 25PPM; Part Number: CPF-A-0603B1K0E; Manufacturer: TE Connectivity
  R1: ClassName: USB to UART PHY
  R20: ClassName: Aux Digital
R2 R5 = RES: Thin Film Resistors - SMD 0603 27ohms 50ppm 0.5%; Part Number: ERA-3AHD270V; Manufacturer: Panasonic; ClassName: USB to UART PHY
R3 R4 R14 R15 = RES: Thick Film Resistors - SMD 0603 5.1Kohm 5% High Voltage; Part Number: KTR03EZPJ512; Manufacturer: ROHM Semiconductor
  R3 R4: ClassName: USB Interface
  R14 R15: ClassName: STM32 MCU
R6 R12 R18 R21 = RES: Thick Film Resistors - SMD 1/5W 10Kohms 1% 100ppm; Part Number: RCC060310K0FKEA; Manufacturer: Vishay
  R6: ClassName: USB to UART PHY
  R12: ClassName: Power Path
  R18: ClassName: STM32 MCU
  R21: ClassName: Aux Digital
R7 = RES: SMD 0.33W Zero ohm Jumper High Power; Part Number: CRCW06030000Z0EAHP; Manufacturer: Vishay; ClassName: USB Interface
R8 R9 R11 = RES: RESISTOR; Part Number: *; Manufacturer: *; ClassName: Power Path
R10 = RES: Thick Film Resistors - SMD 4.32K ohm 1%; Part Number: CR0603-FX-4321ELF; Manufacturer: Bourns; ClassName: Power Path
R13 R17 = RES: Thick Film Resistors - SMD 1M 1% 1/10W; Part Number: CR0603-FX-1004ELF; Manufacturer: Bourns
  R13: ClassName: 3.3V Regulator
  R17: ClassName: 6.0V Regulator
R16 = RES: Thick Film Resistors - SMD 0603 220Kohm 1% Anti Surge AEC-Q200; Part Number: SDR03EZPF2203; Manufacturer: ROHM Semiconductor; ClassName: 3.3V Regulator
R19 = RES: Thick Film Resistors - SMD 0603 249Kohms 0.2W 1% AEC-Q200; Part Number: ERJ-P03F2493V; Manufacturer: Panasonic; ClassName: 6.0V Regulator
S1 = KMR 2 Series: Tactile Switch SPST-NO Top Actuated Surface Mount; Manufacturer: C&K; Part Number: KMR243GFLG; ClassName: STM32 MCU
U1 = USBLC6-2SC6: IC ESD PROTECTION LO CAP SOT23-6; Manufacturer: STMicroelectronics; Part Number: USBLC6-2SC6; ClassName: USB Interface
U2 = BQ24232HA: IC BATT CHG LI-ION 1CELL 16QFN; Manufacturer: Texas Instruments; Part Number: BQ24232HA; ClassName: Power Path
U3 = FT234XD: IC USB SERIAL BASIC UART 12DFN; Part Number: FT234XD-R; Manufacturer: FTDI; ClassName: USB to UART PHY
U4 = LTC3564: IC REG BUCK ADJ 1.25A TSOT23-5; Manufacturer: Linear Technology; Part Number: LTC3564ES5; ClassName: 3.3V Regulator
U5 = STM32G031F6P6: IC MCU 32BIT 32KB FLASH 20TSSOP; Manufacturer: STMicroelectronics; Part Number: STM32G031F6P6; ClassName: STM32 MCU
U6 = MCP9804: SENSOR DIGITAL -40C-125C 8DFN; Manufacturer: Microchip Technology; Part Number: MCP9804T-E/MC; ClassName: Aux Digital
U7 = LTC3539: IC REG BOOST ADJUSTABLE 2A 8DFN; Part Number: LTC3539EDCB-2#TRMPBF; Manufacturer: Analog Devices Inc.; ClassName: 6.0V Regulator
U8 = ADP7142AUJZ-3.3-R7: Manufacturer: Analog Devices; ClassName: 5.0V Regulator; Part Number: ADP7142AUJZ-5.0-R7
J2 = JST-PH-SMT: ClassName: Power Path
TP1 TP2 = TEST POINT: ClassName: Aux Digital

## Sheet NIR-Spec-Motherboard-SCH_SH3_(02).SchDoc: SCHEMATIC
size 863 x 558 mm; DocumentNumber: NIR-Spec-3; SheetNumber: 3; SheetTotal: 3; PageSetup: Record=PageOptions|CenterHorizontal=True|CenterVertical=True|PrintScale=0.98|XCorrection=1.00|YCorrection=1.00|PrintKind=2|BorderSize=5000000|LeftOffset=0|BottomOffset=0|Orientation=2|PaperLength=1000|PaperWidth=1000|Scale=100|PaperSource=15|PrintQuality=1200|MediaType=1|DitherType=10|PaperKind=11 x 17|PrintScaleMode=1
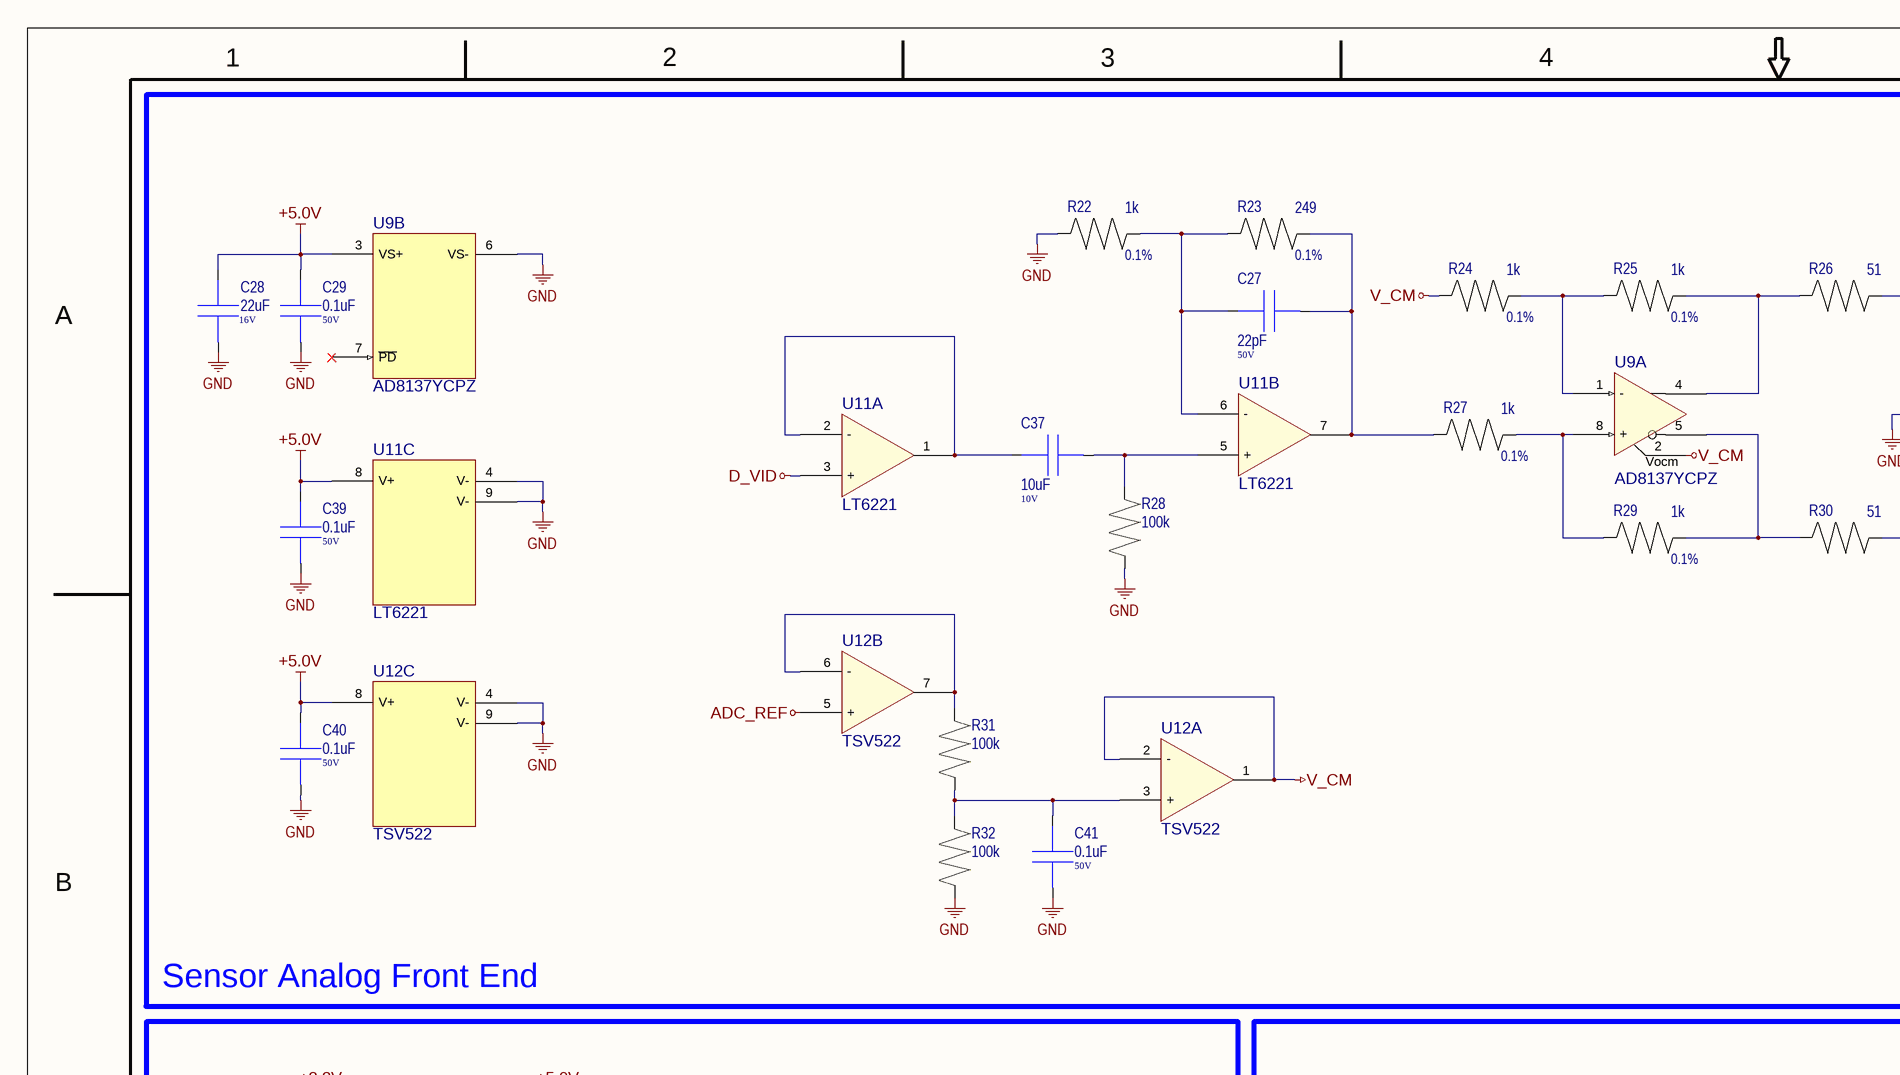
[diagram p10: NIR-Spec-Motherboard-SCH_SH3_(02).SchDoc, top left]
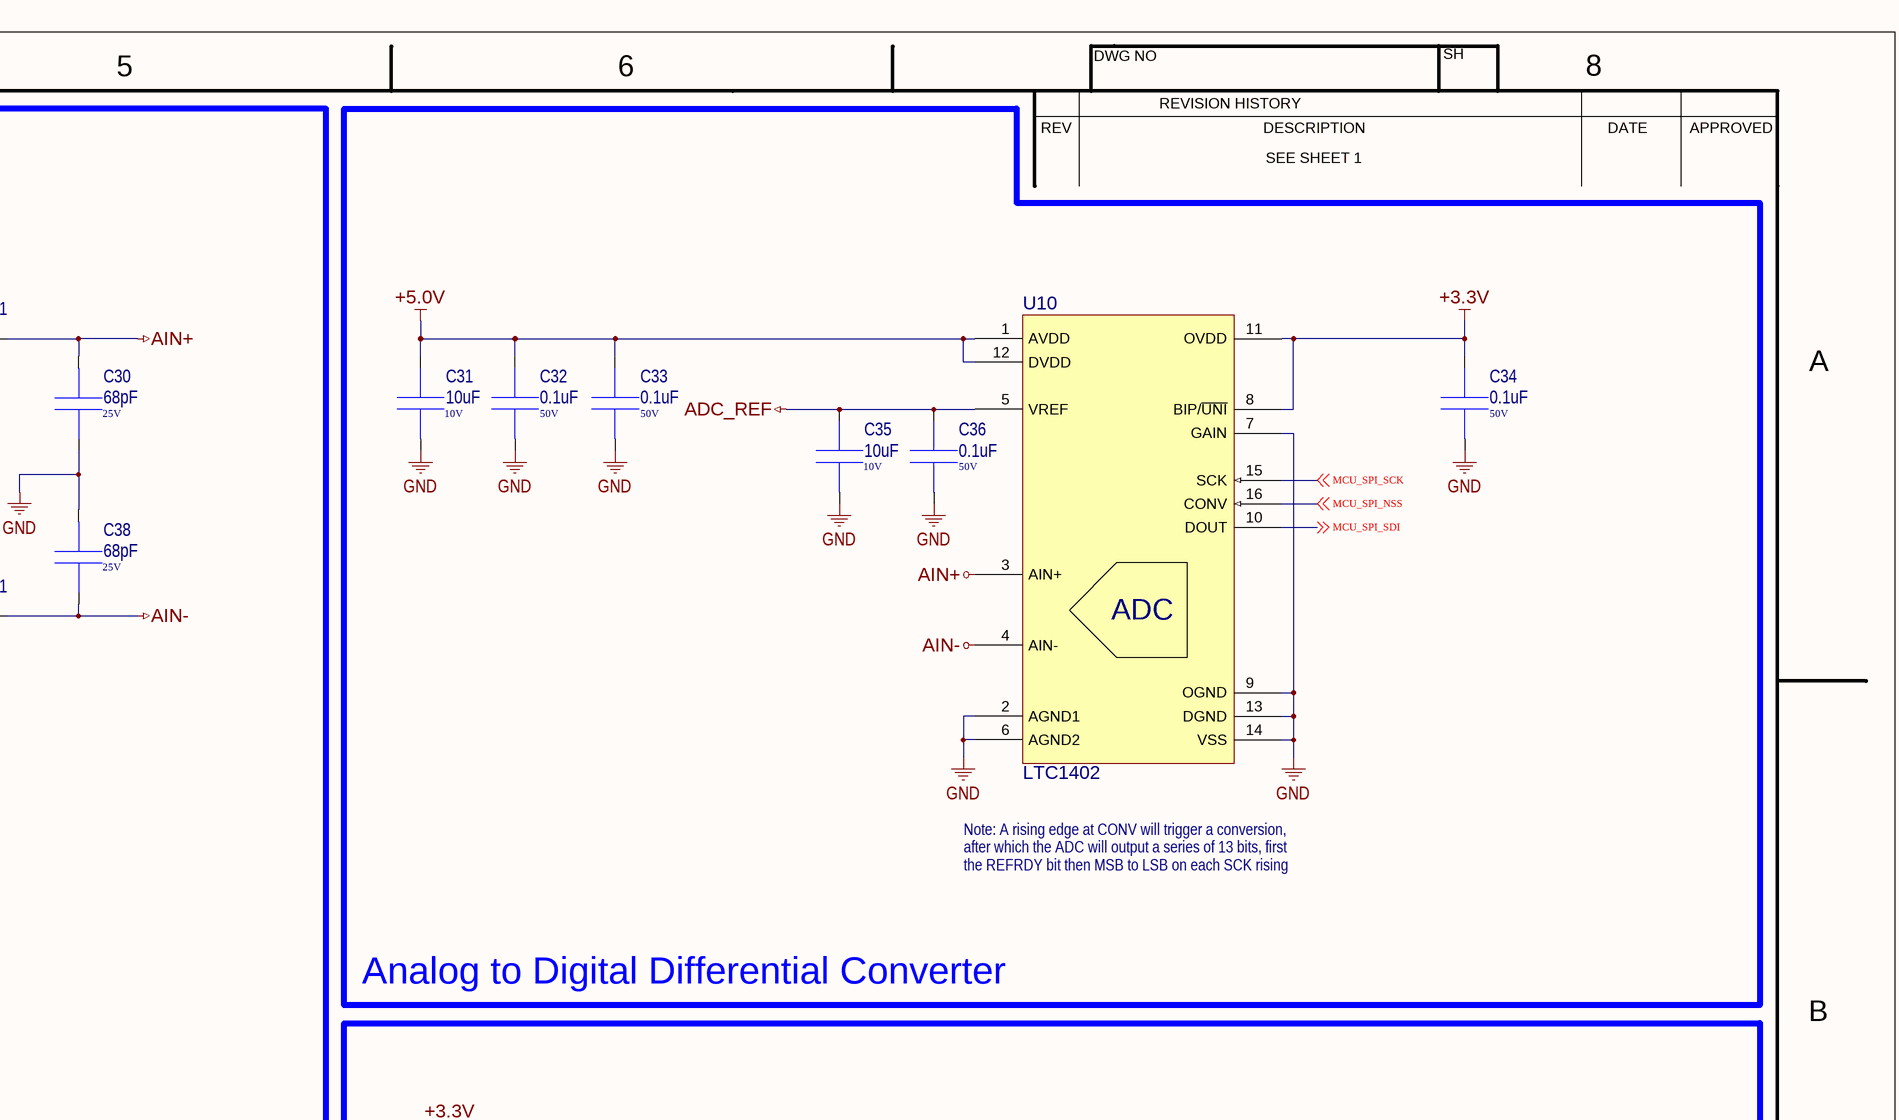
[diagram p11: NIR-Spec-Motherboard-SCH_SH3_(02).SchDoc, top right]
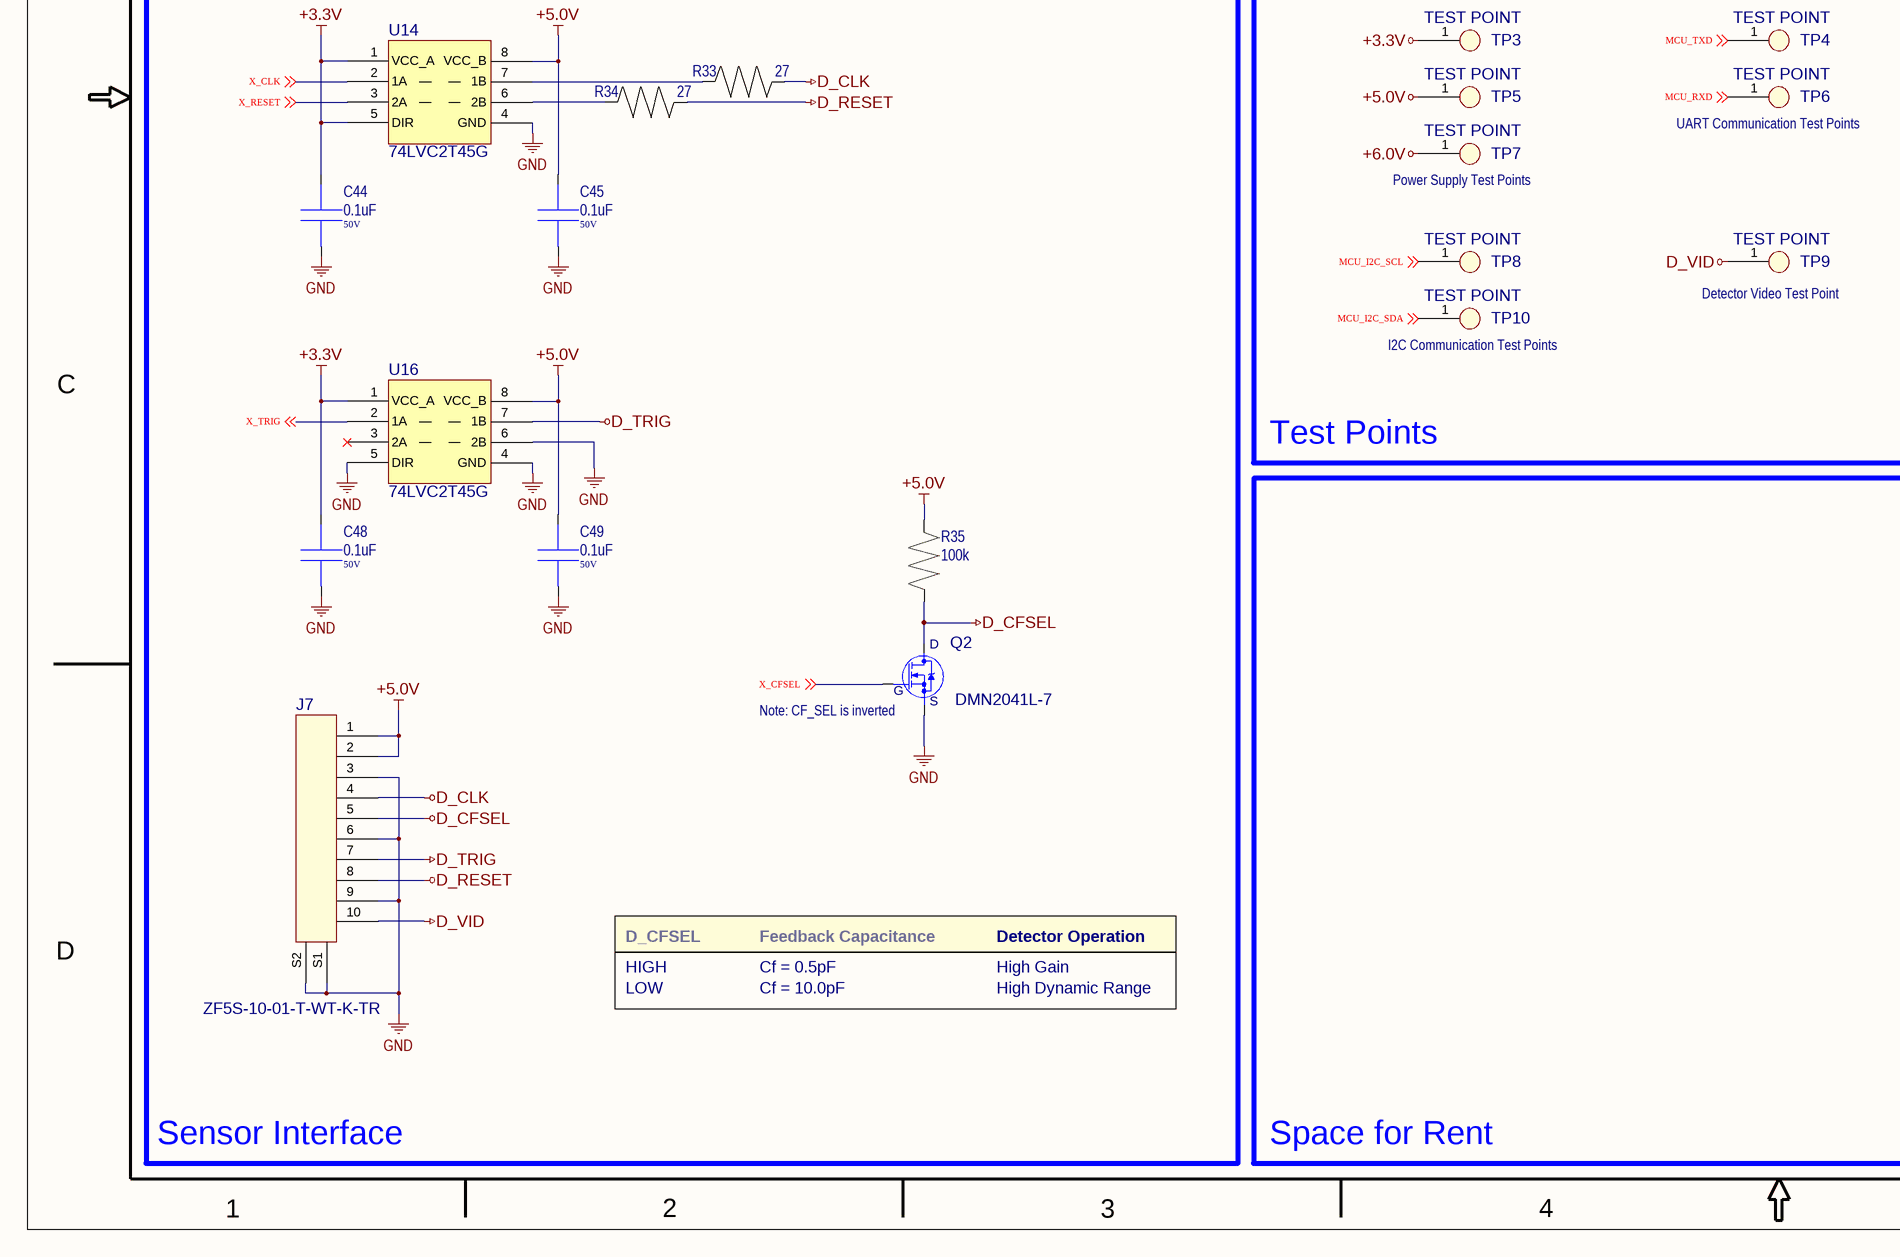
[diagram p12: NIR-Spec-Motherboard-SCH_SH3_(02).SchDoc, bottom left]
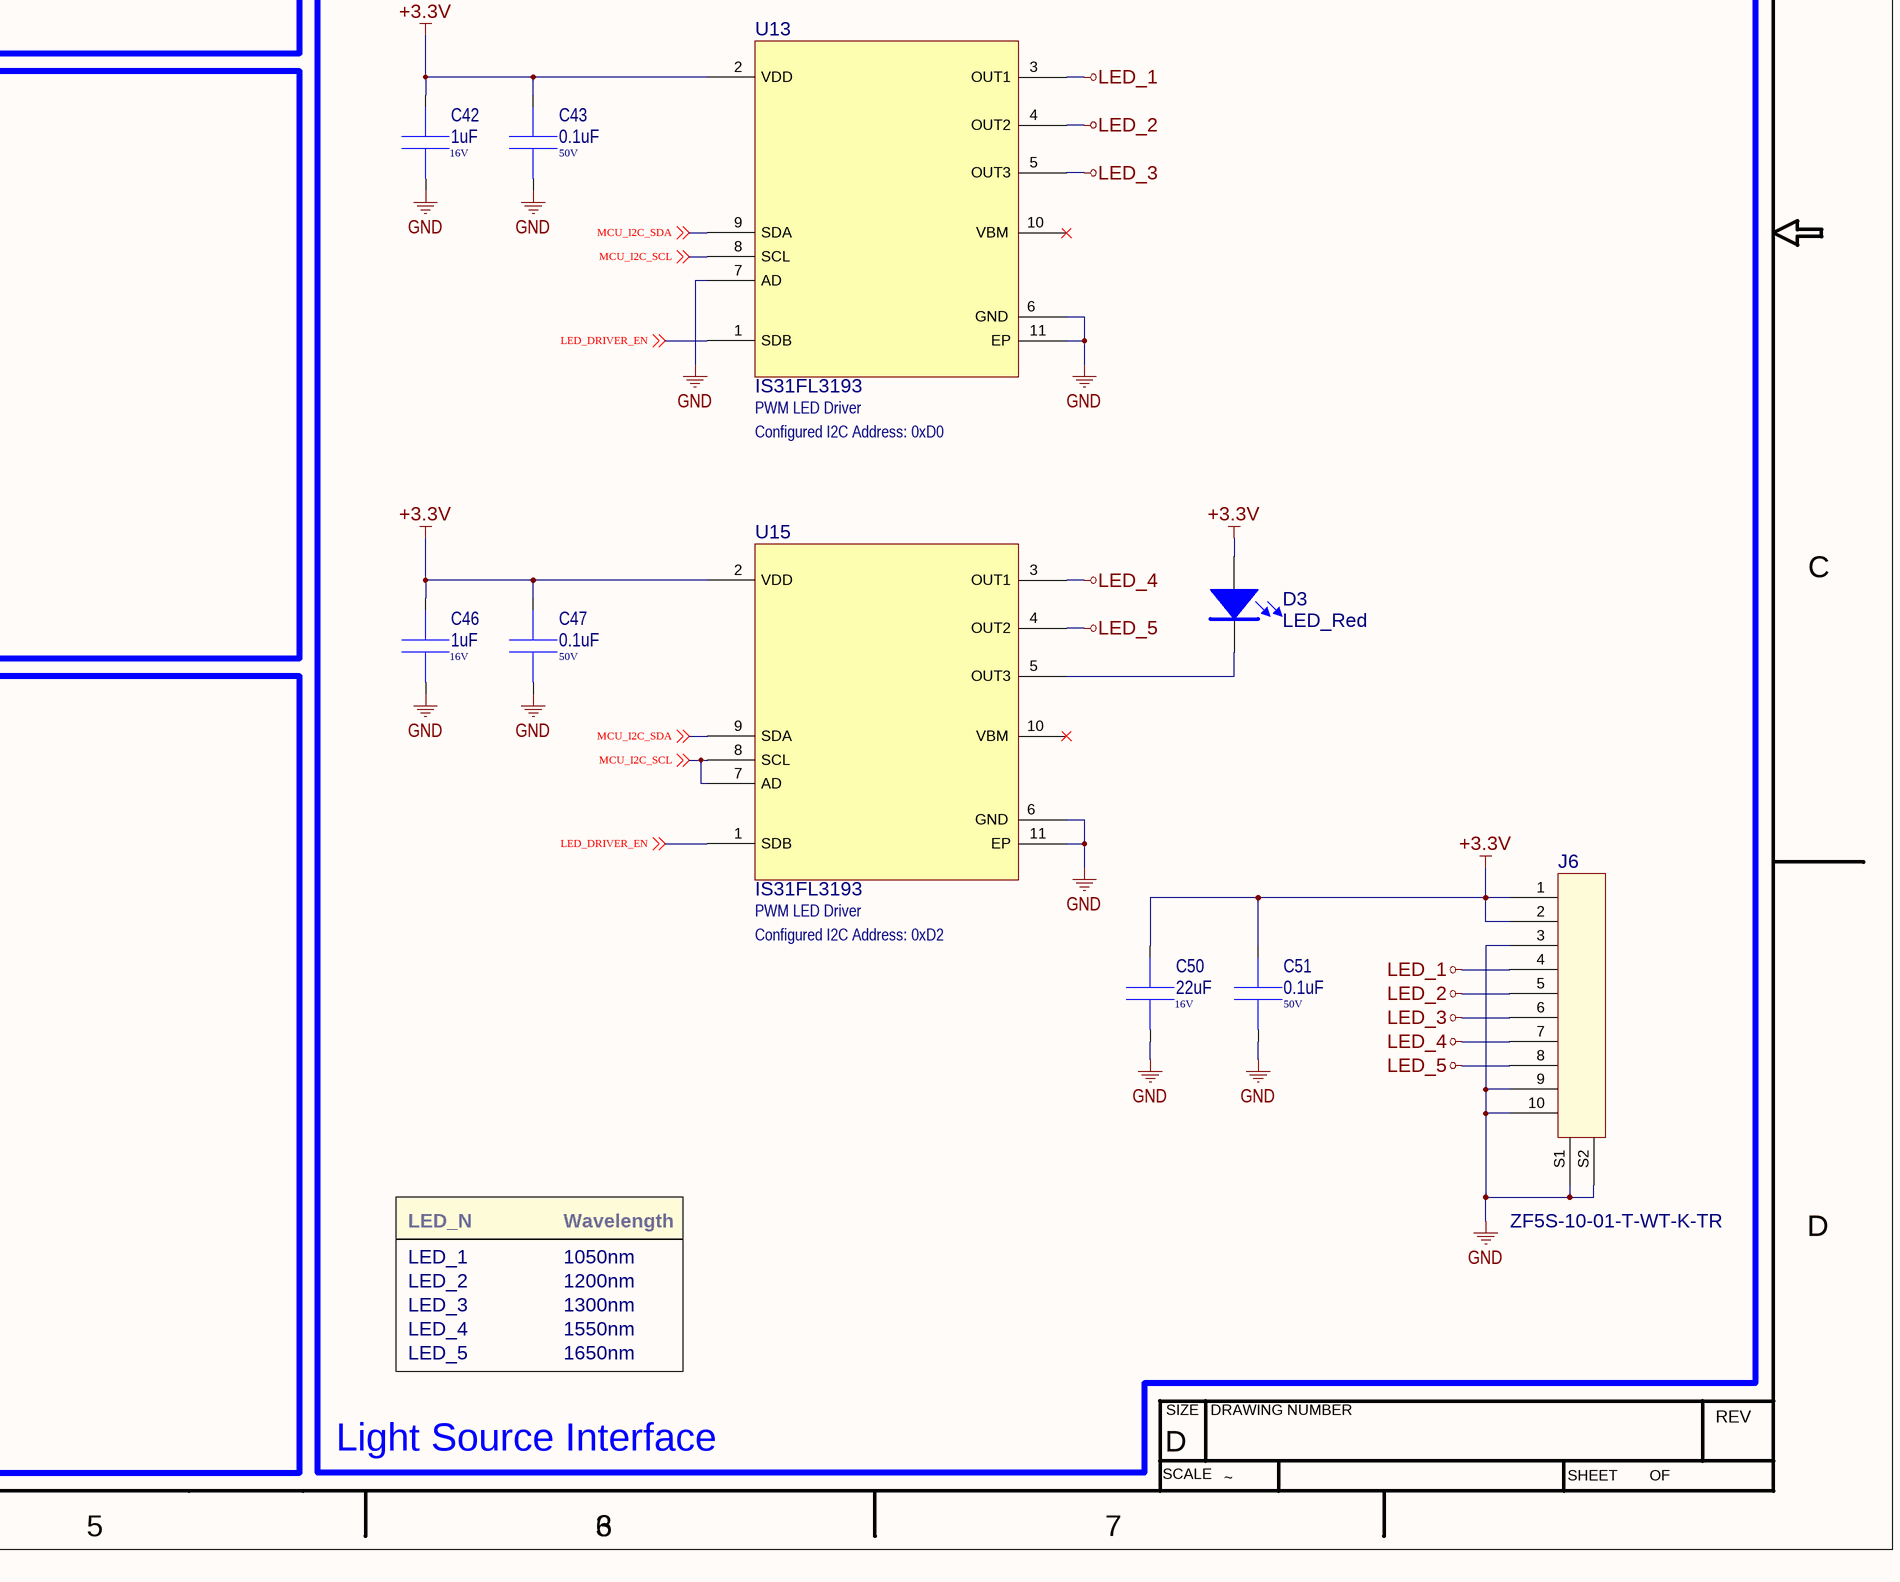
[diagram p13: NIR-Spec-Motherboard-SCH_SH3_(02).SchDoc, bottom right]

### Parts
C27  22pF  Voltage: 50V  [0603]
C28  22uF  Voltage: 16V  [0805]
C29  0.1uF  Voltage: 50V  [0603]
C30  68pF  Voltage: 25V  [0603]
C31  10uF  Voltage: 10V  [0603]
C32  0.1uF  Voltage: 50V  [0603]
C33  0.1uF  Voltage: 50V  [0603]
C34  0.1uF  Voltage: 50V  [0603]
C35  10uF  Voltage: 10V  [0603]
C36  0.1uF  Voltage: 50V  [0603]
C37  10uF  Voltage: 10V  [0603]
C38  68pF  Voltage: 25V  [0603]
C39  0.1uF  Voltage: 50V  [0603]
C40  0.1uF  Voltage: 50V  [0603]
C41  0.1uF  Voltage: 50V  [0603]
C42  1uF  Voltage: 16V  [0603]
C43  0.1uF  Voltage: 50V  [0603]
C44  0.1uF  Voltage: 50V  [0603]
C45  0.1uF  Voltage: 50V  [0603]
C46  1uF  Voltage: 16V  [0603]
C47  0.1uF  Voltage: 50V  [0603]
C48  0.1uF  Voltage: 50V  [0603]
C49  0.1uF  Voltage: 50V  [0603]
C50  22uF  Voltage: 16V  [0805]
C51  0.1uF  Voltage: 50V  [0603]
D3  LED_Red  [0603_LED_Red]
J6  ZF5S-10-01-T-WT-K-TR  [ZF5S-10-01-T-WT-K-TR]
J7  ZF5S-10-01-T-WT-K-TR  [ZF5S-10-01-T-WT-K-TR]
Q2  DMN2041L-7  [SOT-23]
R22  1k  [0603]
R23  249  [0603]
R24  1k  [0603]
R25  1k  [0603]
R26  51  [0603]
R27  1k  [0603]
R28  100k  [0603]
R29  1k  [0603]
R30  51  [0603]
R31  100k  [0603]
R32  100k  [0603]
R33  27  [0603]
R34  27  [0603]
R35  100k  [0603]
TP3  TEST POINT  [30x40 TP]
TP4  TEST POINT  [30x40 TP]
TP5  TEST POINT  [30x40 TP]
TP6  TEST POINT  [30x40 TP]
TP7  TEST POINT  [30x40 TP]
TP8  TEST POINT  [30x40 TP]
TP9  TEST POINT  [30x40 TP]
TP10  TEST POINT  [30x40 TP]
U9  AD8137YCPZ  [SOIC_8]  (parts A,B of 2)
U10  LTC1402  [LTC1402]
U11  LT6221  [DFN-8(3x3)]  (parts A,B,C of 3)
U12  TSV522  [DFN-8 2x2]  (parts A,B,C of 3)
U13  IS31FL3193  [DFN-10]
U14  74LVC2T45G  [SOT-765]
U15  IS31FL3193  [DFN-10]
U16  74LVC2T45G  [SOT-765]

### Blocks framed on the sheet
Sensor Analog Front End: C27-C30 C37-C41 R22-R32 U9 U11 U12
Analog to Digital Differential Converter: C31-C36 U10
Light Source Interface: C42 C43 C46 C47 C50 C51 D3 J6 U13 U15
Sensor Interface: C44 C45 C48 C49 J7 Q2 R33-R35 U14 U16
Test Points: TP3-TP10

### Nets
+3.3V: C34.2 C42.2 C43.2 C44.2 C46.2 C47.2 C48.2 C50.2 C51.2 D3.1(A) J6.1 J6.2 TP3.1 U10.8(BIP/~{UNI}) U10.11(OVDD) U13.2(VDD) U14.1(VCC_A) U14.5(DIR) U15.2(VDD) U16.1(VCC_A)
+5.0V: C28.2 C29.2 C31.2 C32.2 C33.2 C39.2 C40.2 C45.2 C49.2 J7.1 J7.2 R35.1 TP5.1 U9.3(VS+) U10.1(AVDD) U10.12(DVDD) U11.8(V+) U12.8(V+) U14.8(VCC_B) U16.8(VCC_B)
+6.0V: TP7.1
ADC_REF: C35.2 C36.2 U10.5(VREF) U12.5(+)
AIN+: C30.1 R26.2 U10.3(AIN+)
AIN-: C38.2 R30.2 U10.4(AIN-)
D_CFSEL: J7.5 Q2.2(D) R35.2
D_CLK: J7.4 R33.2
D_RESET: J7.8 R34.2
D_TRIG: J7.7 U16.7(1B)
D_VID: J7.10 TP9.1 U11.3(+)
GND: C28.1 C29.1 C30.2 C31.1 C32.1 C33.1 C34.1 C35.1 C36.1 C38.1 C39.1 C40.1 C41.1 C42.1 C43.1 C44.1 C45.1 C46.1 C47.1 C48.1 C49.1 C50.1 C51.1 J6.3 J6.9 J6.10 J6.S1 J6.S2 J7.3 J7.6 J7.9 J7.S1 J7.S2 Q2.3(S) R22.1 R28.2 R32.2 U9.6(VS-) U10.2(AGND1) U10.6(AGND2) U10.7(GAIN) U10.9(OGND) U10.13(DGND) U10.14(VSS) U11.4(V-) U11.9(V-) U12.4(V-) U12.9(V-) U13.6(GND) U13.7(AD) U13.11(EP) U14.4(GND) U15.6(GND) U15.11(EP) U16.4(GND) U16.5(DIR) U16.6(2B)
LED_1: J6.4 U13.3(OUT1)
LED_2: J6.5 U13.4(OUT2)
LED_3: J6.6 U13.5(OUT3)
LED_4: J6.7 U15.3(OUT1)
LED_5: J6.8 U15.4(OUT2)
V_CM: R24.1 U9.2(Vocm) U12.1(OUT) U12.2(-)
LED_DRIVER_EN: U13.1(SDB) U15.1(SDB) ; off-sheet LED_DRIVER_EN
MCU_I2C_SCL: TP8.1 U13.8(SCL) U15.7(AD) U15.8(SCL) ; off-sheet MCU_I2C_SCL
MCU_I2C_SDA: TP10.1 U13.9(SDA) U15.9(SDA) ; off-sheet MCU_I2C_SDA
MCU_RXD: TP6.1 ; off-sheet MCU_RXD
MCU_SPI_NSS: U10.16(CONV) ; off-sheet MCU_SPI_NSS
MCU_SPI_SCK: U10.15(SCK) ; off-sheet MCU_SPI_SCK
MCU_SPI_SDI: U10.10(DOUT) ; off-sheet MCU_SPI_SDI
MCU_TXD: TP4.1 ; off-sheet MCU_TXD
X_CFSEL: Q2.1(G) ; off-sheet X_CFSEL
X_CLK: U14.2(1A) ; off-sheet X_CLK
X_RESET: U14.3(2A) ; off-sheet X_RESET
X_TRIG: U16.2(1A) ; off-sheet X_TRIG
NetC27_1: C27.1 R23.2 R27.1 U11.7(OUT)
NetC27_2: C27.2 R22.2 R23.1 U11.6(-)
NetC37_1: C37.1 R28.1 U11.5(+)
NetC37_2: C37.2 U11.1(OUT) U11.2(-)
NetC41_2: C41.2 R31.2 R32.1 U12.3(+)
NetD3_2: D3.2(K) U15.5(OUT3)
NetR24_2: R24.2 R25.1 U9.1(-)
NetR25_2: R25.2 R26.1 U9.4(OUT+)
NetR27_2: R27.2 R29.1 U9.8(+)
NetR29_2: R29.2 R30.1 U9.5(OUT-)
NetR31_1: R31.1 U12.6(-) U12.7(OUT)
NetR33_1: R33.1 U14.7(1B)
NetR34_1: R34.1 U14.6(2B)

Not connected (* = marked no-connect by the designer): U9 7(~{PD})*; U13 10(VBM)*; U15 10(VBM)*; U16 3(2A)*

### Notes on the sheet
- 1
- 2
- 3
- 4
- 5
- 6
- DWG NO
- REVISION HISTORY
- SH
- 8
- REV
- DESCRIPTION
- SEE SHEET 1
- DATE
- APPROVED
- (near R22) 0.1%
- (near R23) 0.1%
- A
- (near R24) 0.1%
- (near R25) 0.1%
- (near R27) 0.1%
- (near R29) 0.1%
- Note: A rising edge at CONV will trigger a conversion,
- after which the ADC will output a series of 13 bits, first
- the REFRDY bit then MSB to LSB on each SCK rising
- B
- (near TP6) UART Communication Test Points
- (near TP7) Power Supply Test Points
- PWM LED Driver
- (near TP9) Detector Video Test Point
- Configured I2C Address: 0xD0
- (near TP10) I2C Communication Test Points
- C
- (near Q2) Note: CF_SEL is inverted
- Configured I2C Address: 0xD2
- D_CFSEL
- Feedback Capacitance
- Detector Operation
- D
- HIGH
- Cf = 0.5pF
- High Gain
- LED_1
- LED_N
- 1050nm
- Wavelength
- LOW
- Cf = 10.0pF
- High Dynamic Range
- LED_2
- LED_3
- LED_4
- 1200nm
- 1300nm
- 1550nm
- LED_5
- 1650nm
- Space for Rent
- SIZE
- DRAWING NUMBER
- SCALE
- ~
- SHEET        OF
- 7
- (in symbol LTC1402) ADC

### Library data of the parts
C27 = CAP: as C14 on sheet NIR-Spec-Motherboard-SCH_SH2_(02); ClassName: Analog Front End
C28 C50 = CAP: as C4 on sheet NIR-Spec-Motherboard-SCH_SH2_(02)
  C28: ClassName: Analog Front End
  C50: ClassName: LED Drivers
C29 C32-C34 C36 C39-C41 C43-C45 C47-C49 C51 = CAP: as C2 on sheet NIR-Spec-Motherboard-SCH_SH2_(02)
  C29 C39-C41: ClassName: Analog Front End
  C32-C34 C36: ClassName: A/D Converter
  C43 C47 C51: ClassName: LED Drivers
  C44 C45 C48 C49: ClassName: Sensor Interface
C30 C38 = CAP: CAP CER 68PF 25V NP0 0603; Part Number: VJ0603A680KXXPW1BC; Manufacturer: Vishay; ClassName: Analog Front End
C31 C35 C37 = CAP: as C13 on sheet NIR-Spec-Motherboard-SCH_SH2_(02)
  C31 C35: ClassName: A/D Converter
  C37: ClassName: Analog Front End
C42 C46 = CAP: as C1 on sheet NIR-Spec-Motherboard-SCH_SH2_(02); ClassName: LED Drivers
D3 = LED_Red: as D1 on sheet NIR-Spec-Motherboard-SCH_SH2_(02); ClassName: LED Drivers
J6 J7 = ZF5S-10-01-T-WT-K-TR: Manufacturer: Samtec; Part Number: ZF5S-10-01-T-WT-K-TR
  J6: ClassName: LED Drivers
  J7: ClassName: Sensor Interface
Q2 = MOSFET_N: as Q1 on sheet NIR-Spec-Motherboard-SCH_SH2_(02); Part Number: DMN2041L-7; ClassName: Sensor Interface
R22 R24 R25 R27 R29 = RES: as R1 on sheet NIR-Spec-Motherboard-SCH_SH2_(02); ClassName: Analog Front End
R23 = RES: Thin Film Resistors - SMD 0603 249ohms 25ppm 0.5%; Part Number: ERA-3AED2490V; Manufacturer: Panasonic; ClassName: Analog Front End
R26 R30 = RES: Thin Film Resistors - SMD .1W 51ohm 1% 0603; Part Number: MCT06030C5109FP500; Manufacturer: Vishay; ClassName: Analog Front End
R28 R31 R32 R35 = RES: Thick Film Resistors - SMD 0.33W 100Kohms 5%; Part Number: CRCW0603100KJNEAHP; Manufacturer: Vishay
  R28 R31 R32: ClassName: Analog Front End
  R35: ClassName: Sensor Interface
R33 R34 = RES: as R2 on sheet NIR-Spec-Motherboard-SCH_SH2_(02); ClassName: Sensor Interface
U9 = AD8137YRZ-Rxxxx: IC OPAMP DIFF 110MHZ RRO 8SOIC; Manufacturer: Analog Devices; Part Number: AD8137YCPZ; ClassName: Analog Front End
U10 = LTC1402: 12 Bit Analog to Digital Converter 1 Input 1 SAR 16-SSOP; Manufacturer: Linear Technology; Part Number: LTC1402; ClassName: A/D Converter
U11 = LT6221xDD#TRPBF: IC OPAMP GP 2 CIRCUIT 8DFN; Manufacturer: Linear Technology; Part Number: LT6221xDD#TRPBF; ClassName: Analog Front End
U12 = TSV522: IC CMOS 2 CIRCUIT 8DFN; Manufacturer: ST Microelectronics; Part Number: TSV522IQ2T; ClassName: Analog Front End
U13 U15 = IS31FL3193: IC LED DRIVER LINEAR 42MA 10DFN; Manufacturer: Lumissil Microsystems; Part Number: IS31FL3193-DLS2-TR; ClassName: LED Drivers
U14 U16 = 74LVC2T45G: IC TRNSLTR BIDIRECTIONAL 8XSON; Manufacturer: Nexperia USA; Part Number: 74LVC2T45DC,115; ClassName: Sensor Interface
TP3-TP10 = TEST POINT: ClassName: Test Points

## Nets that join several sheets
+3.3V: NIR-Spec-Motherboard-SCH_SH2_(02) (13 pins), NIR-Spec-Motherboard-SCH_SH3_(02) (20 pins)
+5.0V: NIR-Spec-Motherboard-SCH_SH2_(02) (C26.2 FB4.2), NIR-Spec-Motherboard-SCH_SH3_(02) (20 pins)
GND: NIR-Spec-Motherboard-SCH_SH2_(02) (69 pins), NIR-Spec-Motherboard-SCH_SH3_(02) (57 pins)
LED_DRIVER_EN: NIR-Spec-Motherboard-SCH_SH2_(02) (U5.3), NIR-Spec-Motherboard-SCH_SH3_(02) (U13.1 U15.1)
MCU_I2C_SCL: NIR-Spec-Motherboard-SCH_SH2_(02) (J3.4 R15.1 U5.20 U6.2), NIR-Spec-Motherboard-SCH_SH3_(02) (TP8.1 U13.8 U15.7 U15.8)
MCU_I2C_SDA: NIR-Spec-Motherboard-SCH_SH2_(02) (J3.3 R14.1 U5.1 U6.1), NIR-Spec-Motherboard-SCH_SH3_(02) (TP10.1 U13.9 U15.9)
MCU_RXD: NIR-Spec-Motherboard-SCH_SH2_(02) (J5.4 U3.7 U5.10), NIR-Spec-Motherboard-SCH_SH3_(02) (TP6.1)
MCU_SPI_NSS: NIR-Spec-Motherboard-SCH_SH2_(02) (U5.11), NIR-Spec-Motherboard-SCH_SH3_(02) (U10.16)
MCU_SPI_SCK: NIR-Spec-Motherboard-SCH_SH2_(02) (U5.12), NIR-Spec-Motherboard-SCH_SH3_(02) (U10.15)
MCU_SPI_SDI: NIR-Spec-Motherboard-SCH_SH2_(02) (U5.13), NIR-Spec-Motherboard-SCH_SH3_(02) (U10.10)
MCU_TXD: NIR-Spec-Motherboard-SCH_SH2_(02) (J5.3 U3.10 U5.9), NIR-Spec-Motherboard-SCH_SH3_(02) (TP4.1)
X_CFSEL: NIR-Spec-Motherboard-SCH_SH2_(02) (U5.14), NIR-Spec-Motherboard-SCH_SH3_(02) (Q2.1)
X_CLK: NIR-Spec-Motherboard-SCH_SH2_(02) (U5.15), NIR-Spec-Motherboard-SCH_SH3_(02) (U14.2)
X_RESET: NIR-Spec-Motherboard-SCH_SH2_(02) (U5.16), NIR-Spec-Motherboard-SCH_SH3_(02) (U14.3)
X_TRIG: NIR-Spec-Motherboard-SCH_SH2_(02) (U5.17), NIR-Spec-Motherboard-SCH_SH3_(02) (U16.2)